# EAGLE design Controller Rev 3 (EAGLE 6.5.0)
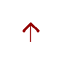
[diagram p0: schematic, sheet 1, part 1 of 3]
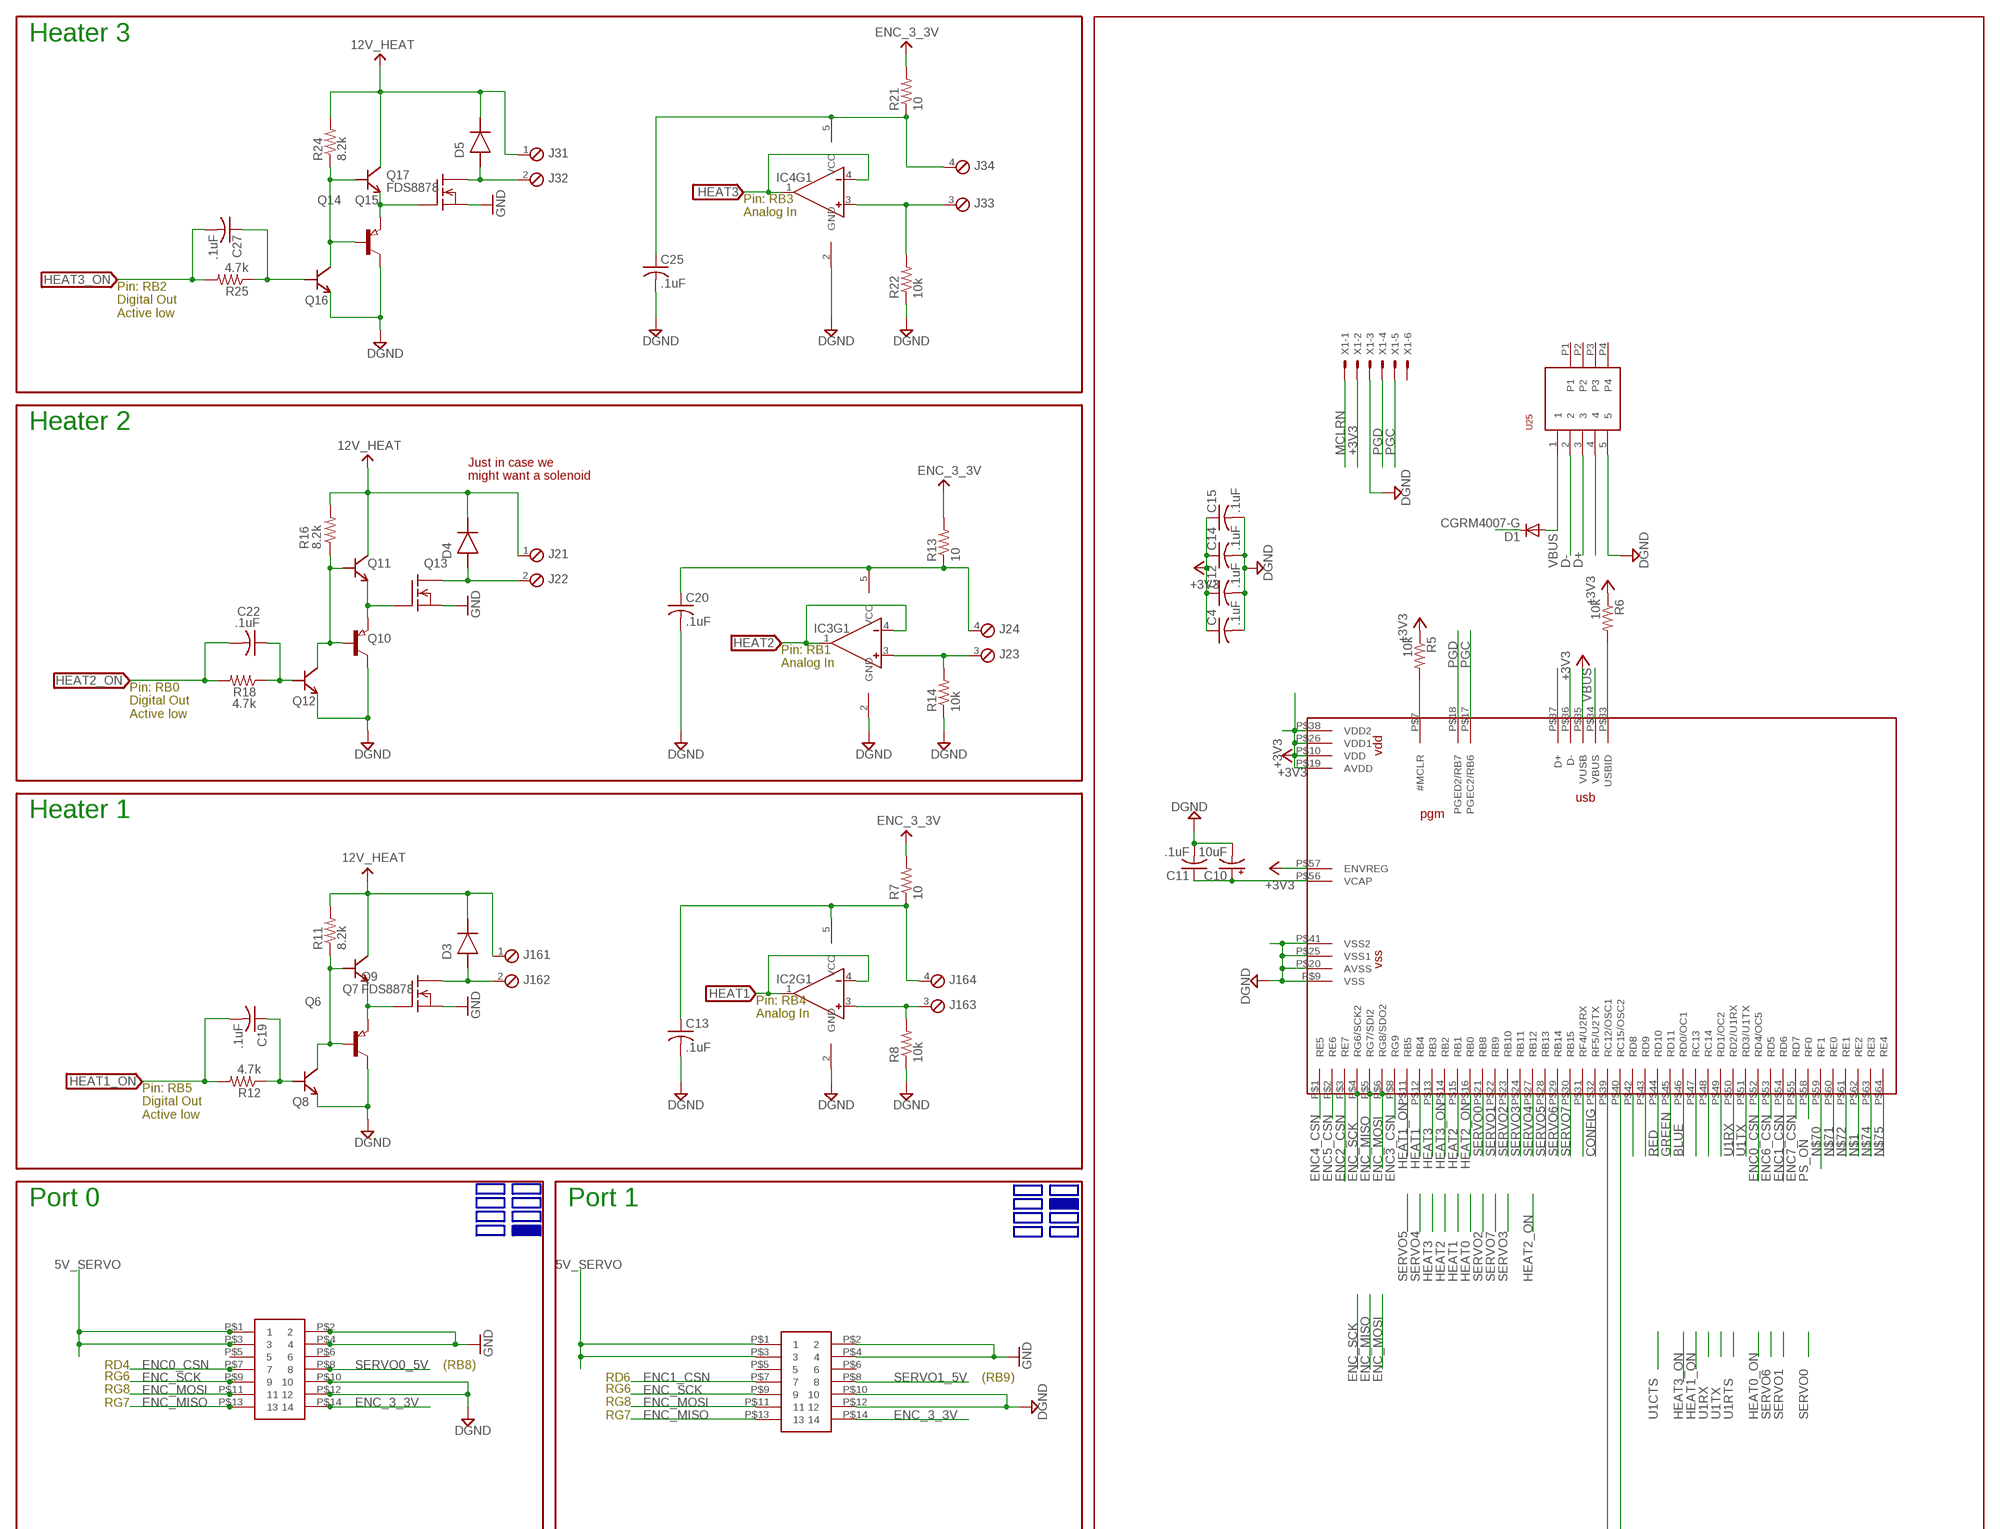
[diagram p1: schematic, sheet 1, part 2 of 3]
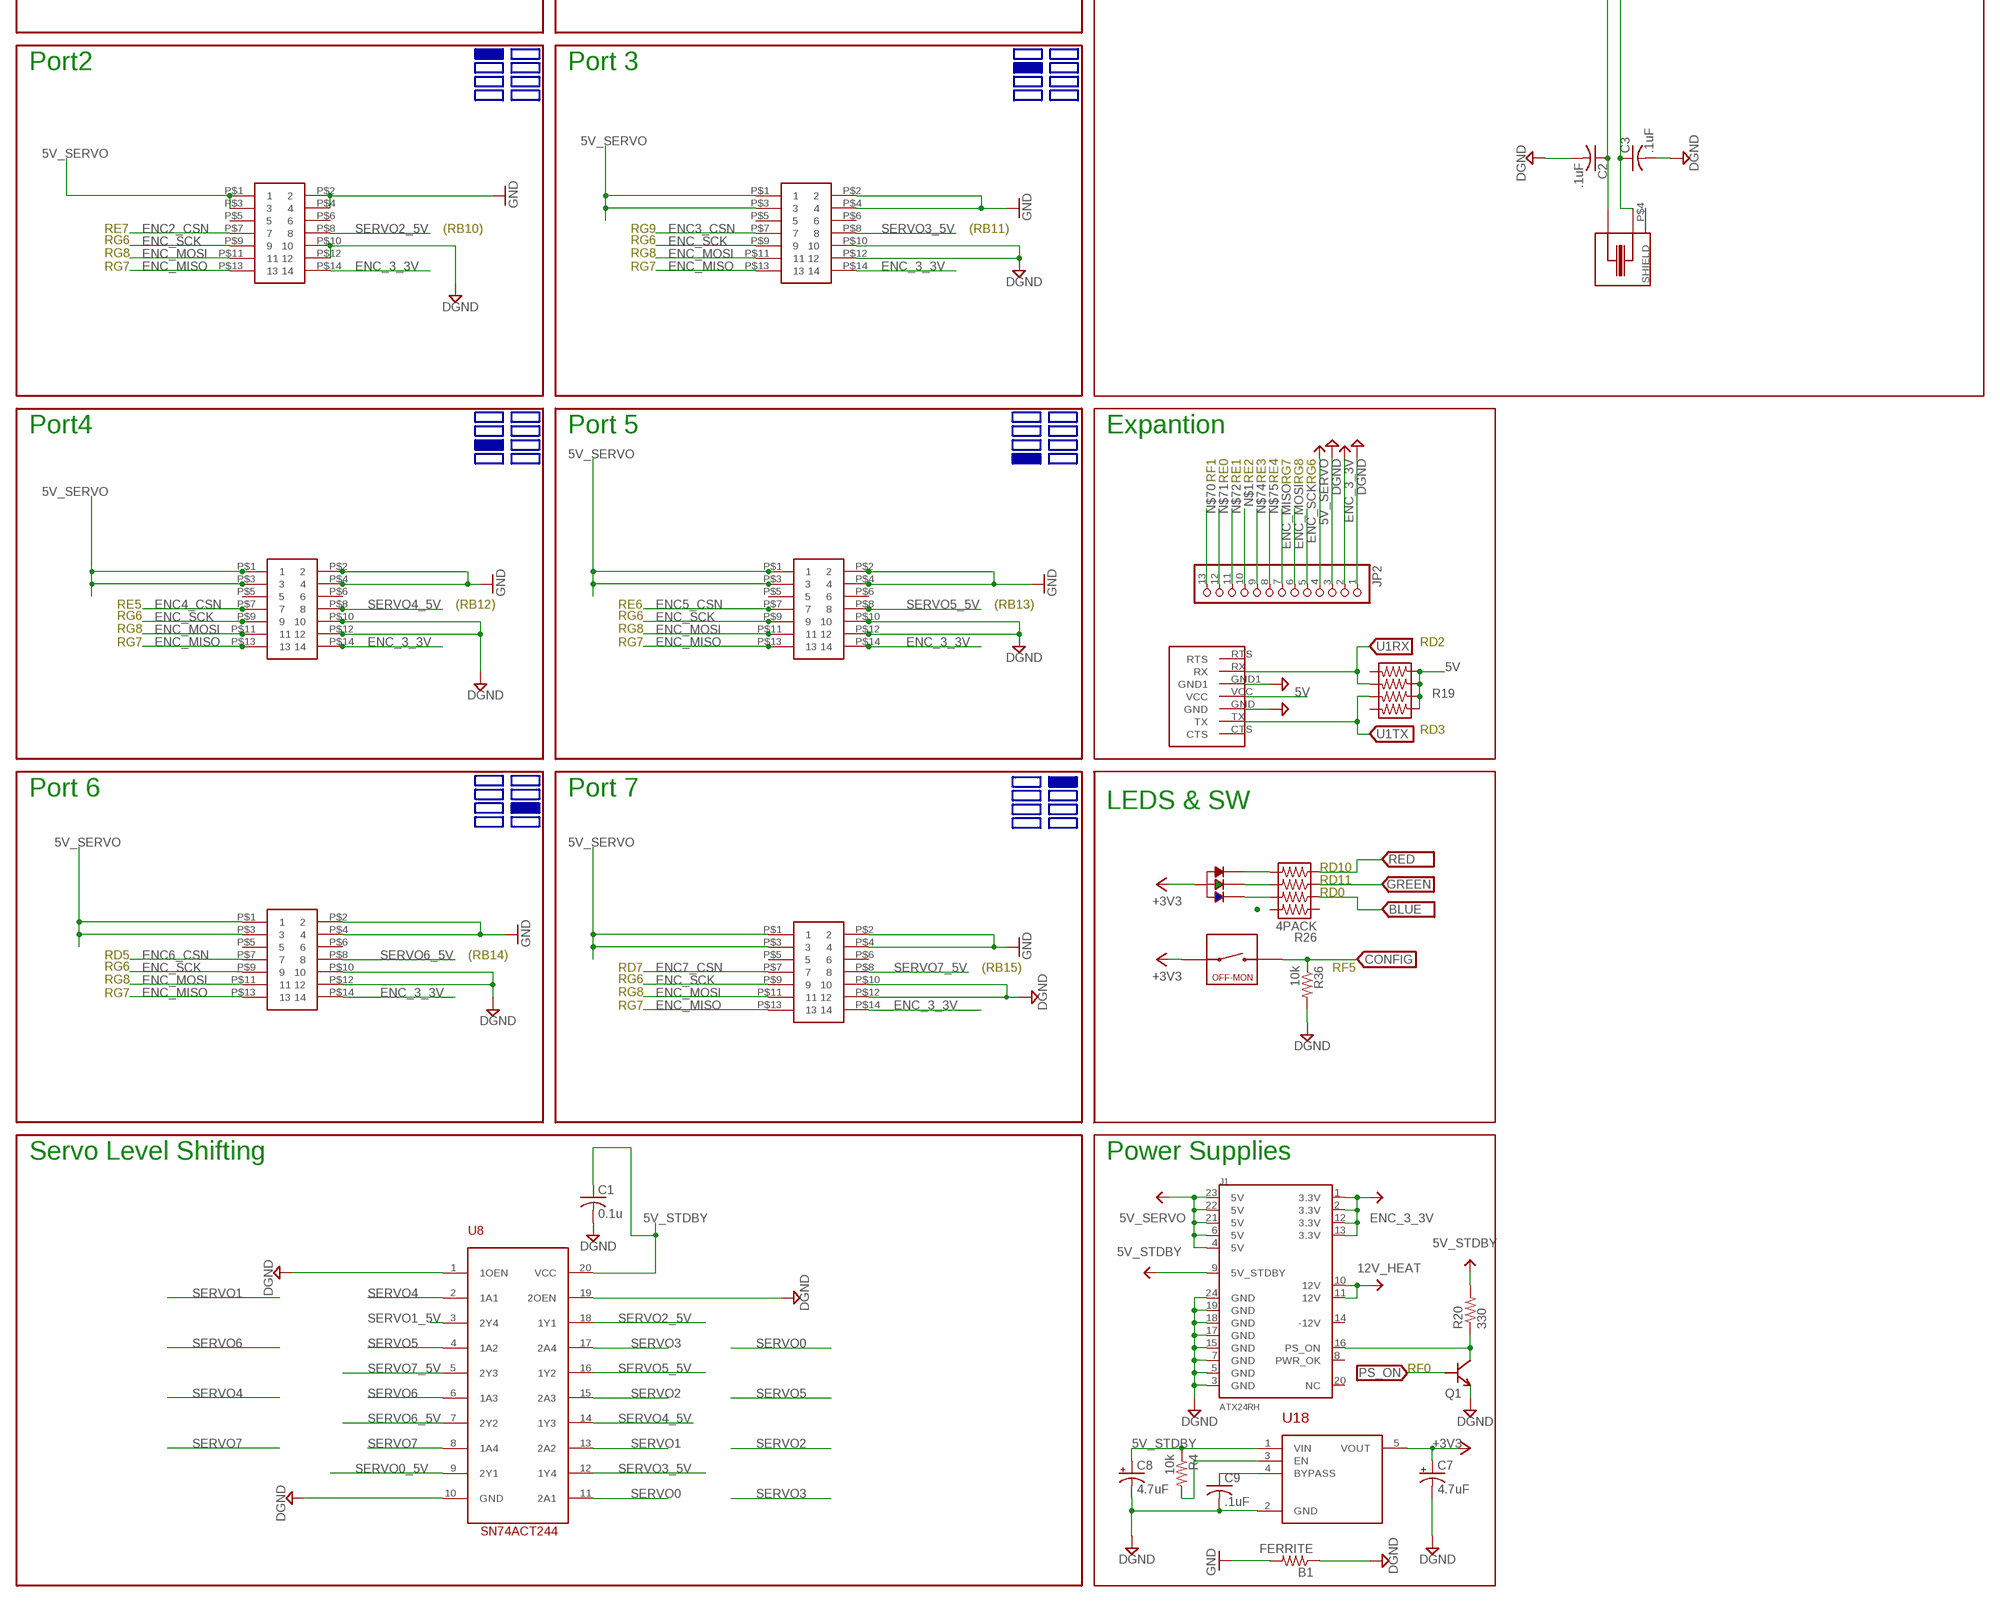
[diagram p2: schematic, sheet 1, part 3 of 3]

## Parts
B1  FERRITE  R-US_R0603  [R0603]
C1  0.1u  C-USC0402  [C0402]
C2  .1uF  C-USC0603  [C0603]
C3  .1uF  C-USC0603  [C0603]
C4  .1uF  C-USC0603  [C0603]
C7  4.7uF  CPOL-USR/2012-12R  [R/2012-12R]
C8  4.7uF  CPOL-USR/2012-12R  [R/2012-12R]
C9  .1uF  C-USC0402  [C0402]
C10  10uF  CPOL-USR/2012-12R  [R/2012-12R]
C11  .1uF  C-USC0603  [C0603]
C12  .1uF  C-USC0603  [C0603]
C13  .1uF  C-USC0603  [C0603]
C14  .1uF  C-USC0603  [C0603]
C15  .1uF  C-USC0603  [C0603]
C19  .1uF  C-USC0603  [C0603]
C20  .1uF  C-USC0603  [C0603]
C22  .1uF  C-USC0603  [C0603]
C25  .1uF  C-USC0603  [C0603]
C27  .1uF  C-USC0603  [C0603]
D1  CGRM4007-G  [SOD-123_MINI-SMA]
D3  DISCRETE_DIODESMA  [DISCRETE_SMA]
D4  DISCRETE_DIODESMA  [DISCRETE_SMA]
D5  DISCRETE_DIODESMA  [DISCRETE_SMA]
IC2  MICROCHIP_MCP6001-LT  [MICROCHIP_SC70-5-LT]
IC3  MICROCHIP_MCP6001-LT  [MICROCHIP_SC70-5-LT]
IC4  MICROCHIP_MCP6001-LT  [MICROCHIP_SC70-5-LT]
J1  ATX24RH  [ATX24_RIGHT_ANGLE]
J2  OSTVN04A150  [4POL254]
J3  OSTVN04A150  [4POL254]
J10  WASP7PIN  [WASP7PIN]
J16  OSTVN04A150  [4POL254]
JP2  PINHD-1X13_BIG  [1X13-BIG]
Q1  DISCRETE_MMBT3904LT1G  [DISCRETE_SOT23]
Q6  PNP-TRANSISTOR_SOT23  [SOT23]
Q7  DISCRETE_MMBT3904LT1G  [DISCRETE_SOT23]
Q8  DISCRETE_MMBT3904LT1G  [DISCRETE_SOT23]
Q9  FDS8878  FDS5680  [SO-8]
Q10  PNP-TRANSISTOR_SOT23  [SOT23]
Q11  DISCRETE_MMBT3904LT1G  [DISCRETE_SOT23]
Q12  DISCRETE_MMBT3904LT1G  [DISCRETE_SOT23]
Q13  FDS8878  FDS5680  [SO-8]
Q14  PNP-TRANSISTOR_SOT23  [SOT23]
Q15  DISCRETE_MMBT3904LT1G  [DISCRETE_SOT23]
Q16  DISCRETE_MMBT3904LT1G  [DISCRETE_SOT23]
Q17  FDS8878  FDS5680  [SO-8]
R4  10k  R-US_R0402  [R0402]
R5  10k  R-US_R0603  [R0603]
R6  10k  R-US_R0603  [R0603]
R7  10  R-US_R0603  [R0603]
R8  10k  R-US_R0603  [R0603]
R11  8.2k  R-US_R0603  [R0603]
R12  4.7k  R-US_R0603  [R0603]
R13  10  R-US_R0603  [R0603]
R14  10k  R-US_R0603  [R0603]
R16  8.2k  R-US_R0603  [R0603]
R18  4.7k  R-US_R0603  [R0603]
R19  4PACK  [4PACK_0603]
R20  330  R-US_R0603  [R0603]
R21  10  R-US_R0603  [R0603]
R22  10k  R-US_R0603  [R0603]
R24  8.2k  R-US_R0603  [R0603]
R25  4.7k  R-US_R0603  [R0603]
R26  4PACK  [4PACK_0603]
R36  10k  R-US_R0603  [R0603]
SW3  SPST  [B3U-1000P]
U1  TRI-LED-SMD  [TRI_LED_SMD]
U3  PIC32-64TQFP64-2  [TQFP64-2]
U8  SN74ACT244  [20-SOIC]
U18  LDS3985XX33  [SOT23-5]
U25  1734035-1_USB  [1734035-1_1734035]
U$1  SBH11-NBPC-D07-SM-BK  [SBH11-NBPC-D07-SM-BK]
U$2  SBH11-NBPC-D07-SM-BK  [SBH11-NBPC-D07-SM-BK]
U$3  SBH11-NBPC-D07-SM-BK  [SBH11-NBPC-D07-SM-BK]
U$4  SBH11-NBPC-D07-SM-BK  [SBH11-NBPC-D07-SM-BK]
U$5  SBH11-NBPC-D07-SM-BK  [SBH11-NBPC-D07-SM-BK]
U$6  SBH11-NBPC-D07-SM-BK  [SBH11-NBPC-D07-SM-BK]
U$7  SBH11-NBPC-D07-SM-BK  [SBH11-NBPC-D07-SM-BK]
U$8  SBH11-NBPC-D07-SM-BK  [SBH11-NBPC-D07-SM-BK]
X1  22-23-2061  [22-23-2061]
X2  CMR3XXT  [CMR309T]

## Nets
5V: J10.VCC R19.R1B R19.R2B R19.R3B R19.R4B
5V_SERVO: J1.4(5V) J1.6(5V) J1.21(5V) J1.22(5V) J1.23(5V) JP2.4 U$1.P$1 U$1.P$3 U$2.P$1 U$2.P$3 U$3.P$1 U$3.P$3 U$4.P$1 U$4.P$3 U$5.P$1 U$5.P$3 U$6.P$1 U$6.P$3 U$7.P$1 U$7.P$3 U$8.P$1 U$8.P$3
5V_STDBY: C1.1 C8.+ D1.C J1.9(5V_STDBY) R4.1 R20.2 U8.20(VCC) U18.1(VIN)
12V_HEAT: D3.C D4.C D5.C J1.10(12V) J1.11(12V) J2.1 J3.1 J16.1 Q7.3(C) Q11.3(C) Q15.3(C) R11.2 R16.2 R24.2
12V_SW1: D3.A J16.2 Q9.5(D) Q9.6(D) Q9.7(D) Q9.8(D)
12V_SW2: D4.A J2.2 Q13.5(D) Q13.6(D) Q13.7(D) Q13.8(D)
12V_SW3: D5.A J3.2 Q17.5(D) Q17.6(D) Q17.7(D) Q17.8(D)
+3V3: C4.1 C7.+ C12.1 C14.1 C15.1 R5.1 R6.1 SW3.P$1 U1.COMM-A U3.P$10(VDD) U3.P$19(AVDD) U3.P$26(VDD1) U3.P$35(VUSB) U3.P$38(VDD2) U3.P$57(ENVREG) U18.5(VOUT) X1.2
B: R26.R2A U1.BLUE
BLUE: R26.R2B U3.P$46(RD0/OC1)
CONFIG: R36.1 SW3.P$3 U3.P$32(RF5/U2TX)
D+: U3.P$37(D+) U25.3
D-: U3.P$36(D-) U25.2
DGND: B1.1 C1.2 C2.2 C3.2 C4.2 C7.- C8.- C9.2 C10.- C11.2 C12.2 C13.2 C14.2 C15.2 C20.2 C25.2 IC2.2(PWR:GND) IC3.2(PWR:GND) IC4.2(PWR:GND) J1.3(GND) J1.5(GND) J1.7(GND) J1.15(GND) J1.17(GND) J1.18(GND) J1.19(GND) J1.24(GND) J10.GND J10.GND1 JP2.1 JP2.3 Q1.2(E) Q6.3(C) Q8.2(E) Q10.3(C) Q12.2(E) Q14.3(C) Q16.2(E) R8.1 R14.1 R22.1 R36.2 U3.P$9(VSS) U3.P$20(AVSS) U3.P$25(VSS1) U3.P$41(VSS2) U8.1(1OEN) U8.10(GND) U8.19(2OEN) U18.2(GND) U25.5 U$1.P$10 U$1.P$12 U$2.P$10 U$2.P$12 U$3.P$10 U$3.P$12 U$4.P$10 U$4.P$12 U$5.P$10 U$5.P$12 U$6.P$10 U$6.P$12 U$7.P$10 U$7.P$12 U$8.P$10 U$8.P$12 X1.3
ENC0_CSN: U3.P$52(RD4/OC5) U$8.P$7
ENC1_CSN: U3.P$54(RD6) U$6.P$7
ENC2_CSN: U3.P$3(RE7) U$1.P$7
ENC3_CSN: U3.P$8(RG9) U$2.P$7
ENC4_CSN: U3.P$1(RE5) U$3.P$7
ENC5_CSN: U3.P$2(RE6) U$4.P$7
ENC6_CSN: U3.P$53(RD5) U$7.P$7
ENC7_CSN: U3.P$55(RD7) U$5.P$7
ENC_3_3V: J1.1(3.3V) J1.2(3.3V) J1.12(3.3V) J1.13(3.3V) JP2.2 R7.2 R13.2 R21.2 U$1.P$14 U$2.P$14 U$3.P$14 U$4.P$14 U$5.P$14 U$6.P$14 U$7.P$14 U$8.P$14
ENC_MISO: JP2.7 U3.P$5(RG7/SDI2) U$1.P$13 U$2.P$13 U$3.P$13 U$4.P$13 U$5.P$13 U$6.P$13 U$7.P$13 U$8.P$13
ENC_MOSI: JP2.6 U3.P$6(RG8/SDO2) U$1.P$11 U$2.P$11 U$3.P$11 U$4.P$11 U$5.P$11 U$6.P$11 U$7.P$11 U$8.P$11
ENC_SCK: JP2.5 U3.P$4(RG6/SCK2) U$1.P$9 U$2.P$9 U$3.P$9 U$4.P$9 U$5.P$9 U$6.P$9 U$7.P$9 U$8.P$9
G: R26.R3A U1.GRN
GND: B1.2 Q9.1(S) Q9.2(S) Q9.3(S) Q13.1(S) Q13.2(S) Q13.3(S) Q17.1(S) Q17.2(S) Q17.3(S) U$1.P$2 U$1.P$4 U$2.P$2 U$2.P$4 U$3.P$2 U$3.P$4 U$4.P$2 U$4.P$4 U$5.P$2 U$5.P$4 U$6.P$2 U$6.P$4 U$7.P$2 U$7.P$4 U$8.P$2 U$8.P$4
GREEN: R26.R3B U3.P$45(RD11)
HEAT1: IC2.1(OUT) IC2.4(IN-) U3.P$12(RB4)
HEAT1_ON: C19.2 R12.2 U3.P$11(RB5)
HEAT2: IC3.1(OUT) IC3.4(IN-) U3.P$15(RB1)
HEAT2_ON: C22.2 R18.2 U3.P$16(RB0)
HEAT3: IC4.1(OUT) IC4.4(IN-) U3.P$13(RB3)
HEAT3_ON: C27.2 R25.2 U3.P$14(RB2)
MCLRN: R5.2 U3.P$7(#MCLR) X1.1
N$1: JP2.10 U3.P$62(RE2)
N$2: R4.2 U18.3(EN)
N$3: C9.1 U18.4(BYPASS)
N$4: C3.1 U3.P$40(RC15/OSC2) X2.P$3
N$5: C10.+ C11.1 U3.P$56(VCAP)
N$6: C2.1 U3.P$39(RC12/OSC1) X2.P$1
N$7: IC2.3(IN+) J16.3 R8.2
N$9: C13.1 IC2.5(PWR:VCC) J16.4 R7.1
N$11: Q6.1(B) Q7.1(B) Q8.3(C) R11.1
N$12: C19.1 Q8.1(B) R12.1
N$15: Q6.2(E) Q7.2(E) Q9.4(G)
N$17: IC3.3(IN+) J2.3 R14.2
N$19: C20.1 IC3.5(PWR:VCC) J2.4 R13.1
N$20: Q10.1(B) Q11.1(B) Q12.3(C) R16.1
N$22: C22.1 Q12.1(B) R18.1
N$23: Q10.2(E) Q11.2(E) Q13.4(G)
N$24: IC4.3(IN+) J3.3 R22.2
N$26: C25.1 IC4.5(PWR:VCC) J3.4 R21.1
N$27: Q14.1(B) Q15.1(B) Q16.3(C) R24.1
N$28: C27.1 Q16.1(B) R25.1
N$29: Q14.2(E) Q15.2(E) Q17.4(G)
N$32: J1.16(PS_ON) Q1.3(C) R20.1
N$53: U3.P$31(RF4/U2RX)
N$55: U3.P$42(RD8)
N$56: U3.P$43(RD9)
N$60: U3.P$47(RC13)
N$61: U3.P$48(RC14)
N$62: U3.P$49(RD1/OC2)
N$70: JP2.13 U3.P$59(RF1)
N$71: JP2.12 U3.P$60(RE0)
N$72: JP2.11 U3.P$61(RE1)
N$74: JP2.9 U3.P$63(RE3)
N$75: JP2.8 U3.P$64(RE4)
PGC: U3.P$17(PGEC2/RB6) X1.5
PGD: U3.P$18(PGED2/RB7) X1.4
PS_ON: Q1.1(B) U3.P$58(RF0)
R: R26.R4A U1.RED
RED: R26.R4B U3.P$44(RD10)
SERVO0: U3.P$21(RB8) U8.11(2A1)
SERVO0_5V: U8.9(2Y1) U$8.P$8
SERVO1: U3.P$22(RB9) U8.13(2A2)
SERVO1_5V: U8.3(2Y4) U$6.P$8
SERVO2: U3.P$23(RB10) U8.15(2A3)
SERVO2_5V: U8.18(1Y1) U$1.P$8
SERVO3: U3.P$24(RB11) U8.17(2A4)
SERVO3_5V: U8.12(1Y4) U$2.P$8
SERVO4: U3.P$27(RB12) U8.2(1A1)
SERVO4_5V: U8.14(1Y3) U$3.P$8
SERVO5: U3.P$28(RB13) U8.4(1A2)
SERVO5_5V: U8.16(1Y2) U$4.P$8
SERVO6: U3.P$29(RB14) U8.6(1A3)
SERVO6_5V: U8.7(2Y2) U$7.P$8
SERVO7: U3.P$30(RB15) U8.8(1A4)
SERVO7_5V: U8.5(2Y3) U$5.P$8
U1RX: J10.RX R19.R2A U3.P$50(RD2/U1RX)
U1TX: J10.TX R19.R3A U3.P$51(RD3/U1TX)
USBID: R6.2 U3.P$33(USBID) U25.4
VBUS: D1.A U3.P$34(VBUS) U25.1
Unconnected: J1.8(PWR_OK) J1.14(-12V) J1.20(NC) J10.CTS J10.RTS R19.R1A R19.R4A R26.R1A R26.R1B U25.P1 U25.P2 U25.P3 U25.P4 U$1.P$5 U$1.P$6 U$2.P$5 U$2.P$6 U$3.P$5 U$3.P$6 U$4.P$5 U$4.P$6 U$5.P$5 U$5.P$6 U$6.P$5 U$6.P$6 U$7.P$5 U$7.P$6 U$8.P$5 U$8.P$6 X1.6 X2.P$4(SHIELD)

## Buses
B$1

## Notes on the sheet
- Heater 3
- Pin: RB3
  Analog In
- Pin: RB2
  Digital Out
  Active low
- Heater 2
- Just in case we
  might want a solenoid
- Pin: RB1
  Analog In
- Pin: RB0
  Digital Out
  Active low
- Heater 1
- Pin: RB4
  Analog In
- Pin: RB5
  Digital Out
  Active low
- Port 0 | Port 1
- RD4 | (RB8)
- RD6 | (RB9)
- RG6
  RG8
  RG7
- RG6
  RG8
  RG7
- Port2 | Port 3
- RE7 | (RB10) | RG9 | (RB11)
- RG6
  RG8
  RG7
- RG6
  RG8
  RG7
- Port4 | Port 5 | Expantion
- RF1 | RE0 | RE1 | RE2 | RE3 | RE4 | RG7 | RG8 | RG6
- RE5 | (RB12) | RE6 | (RB13)
- RG6
  RG8
  RG7
- RG6
  RG8
  RG7
- RD2
- RD3
- Port 6 | Port 7
- LEDS & SW
- RD10
- RD11
- RD0
- RD5 | (RB14)
- RD7 | (RB15) | RF5
- RG6
  RG8
  RG7
- RG6
  RG8
  RG7
- Servo Level Shifting | Power Supplies
- RF0

## Library data of the parts
B1 R4-R8 R11-R14 R16 R18 R20-R22 R24 R25 R36 = rcl:R-US_: RESISTOR, American symbol
C1 = resistor:C-US: CAPACITOR, American symbol
C2-C4 C9 C11-C15 C19 C20 C22 C25 C27 = rcl:C-US: CAPACITOR, American symbol
C7 C8 C10 = rcl:CPOL-US: POLARIZED CAPACITOR, American symbol
D1 = diode:CGRM400*-G: Molded plasitc,JEDEC SOD-123/Mini SMA Source: Comchip CGRM4001-G.pdf
D3-D5 = chipKIT_Max32:DISCRETE_DIODE: Diode
IC2-IC4 = chipKIT_Max32:MICROCHIP_MCP6001: 1 Mhz Low Power Op Amp
J1 = SparkFun-Connectors:ATX24: ATX24 Pin Power Supply Connector This is a good connector for connecting a computer power supply to a PCB. It's massive, but provides many amps of power at 5V and 12V. SKU: PRT-09498
J2 J3 J16 = con-OST-254:OSTVN04A150
J10 = wasp7pin:WASP7PIN
JP2 = adafruit:PINHD-1X13: PIN HEADER
Q1 Q7 Q8 Q11 Q12 Q15 Q16 = chipKIT_Max32:DISCRETE_MMBT3904: General Purpose NPN Transistor
Q6 Q10 Q14 = semicon-smd-ipc:PNP-TRANSISTOR_: PNP TRANSISTOR
Q9 Q13 Q17 = transistor-fet:FDS5680: 60V N-Channel PowerTrench TM MOSFET FAIRCHILD FDS5680.pdf
R19 R26 = ResistorBlocks:4PACK: This is a 0603x4 resistor block. Digikey PN:MNR14103RCT-ND
SW3 = B3U-1000P:SPST
U1 = TRI_LED_SMD:TRI-LED-SMD: Common Annode smd tri-color RGB led.
U3 = pic32:PIC32-64
U8 = SN74ACT244:SN74ACT244
U18 = LDS3985XX33:LDS3985XX33
U25 = YESIN_USB:1734035-1_USB
U$1-U$8 = SBH11-NBPC-D07-SM-BK:SBH11-NBPC-D07-SM-BK
X1 = con-molex:22-23-2061: .100" (2.54mm) Center Header - 6 Pin; MF: MOLEX; MPN: 22-23-2061; OC_FARNELL: 1462922; OC_NEWARK: 27C1933
X2 = cmr3XXT:CMR3XXT

## Board
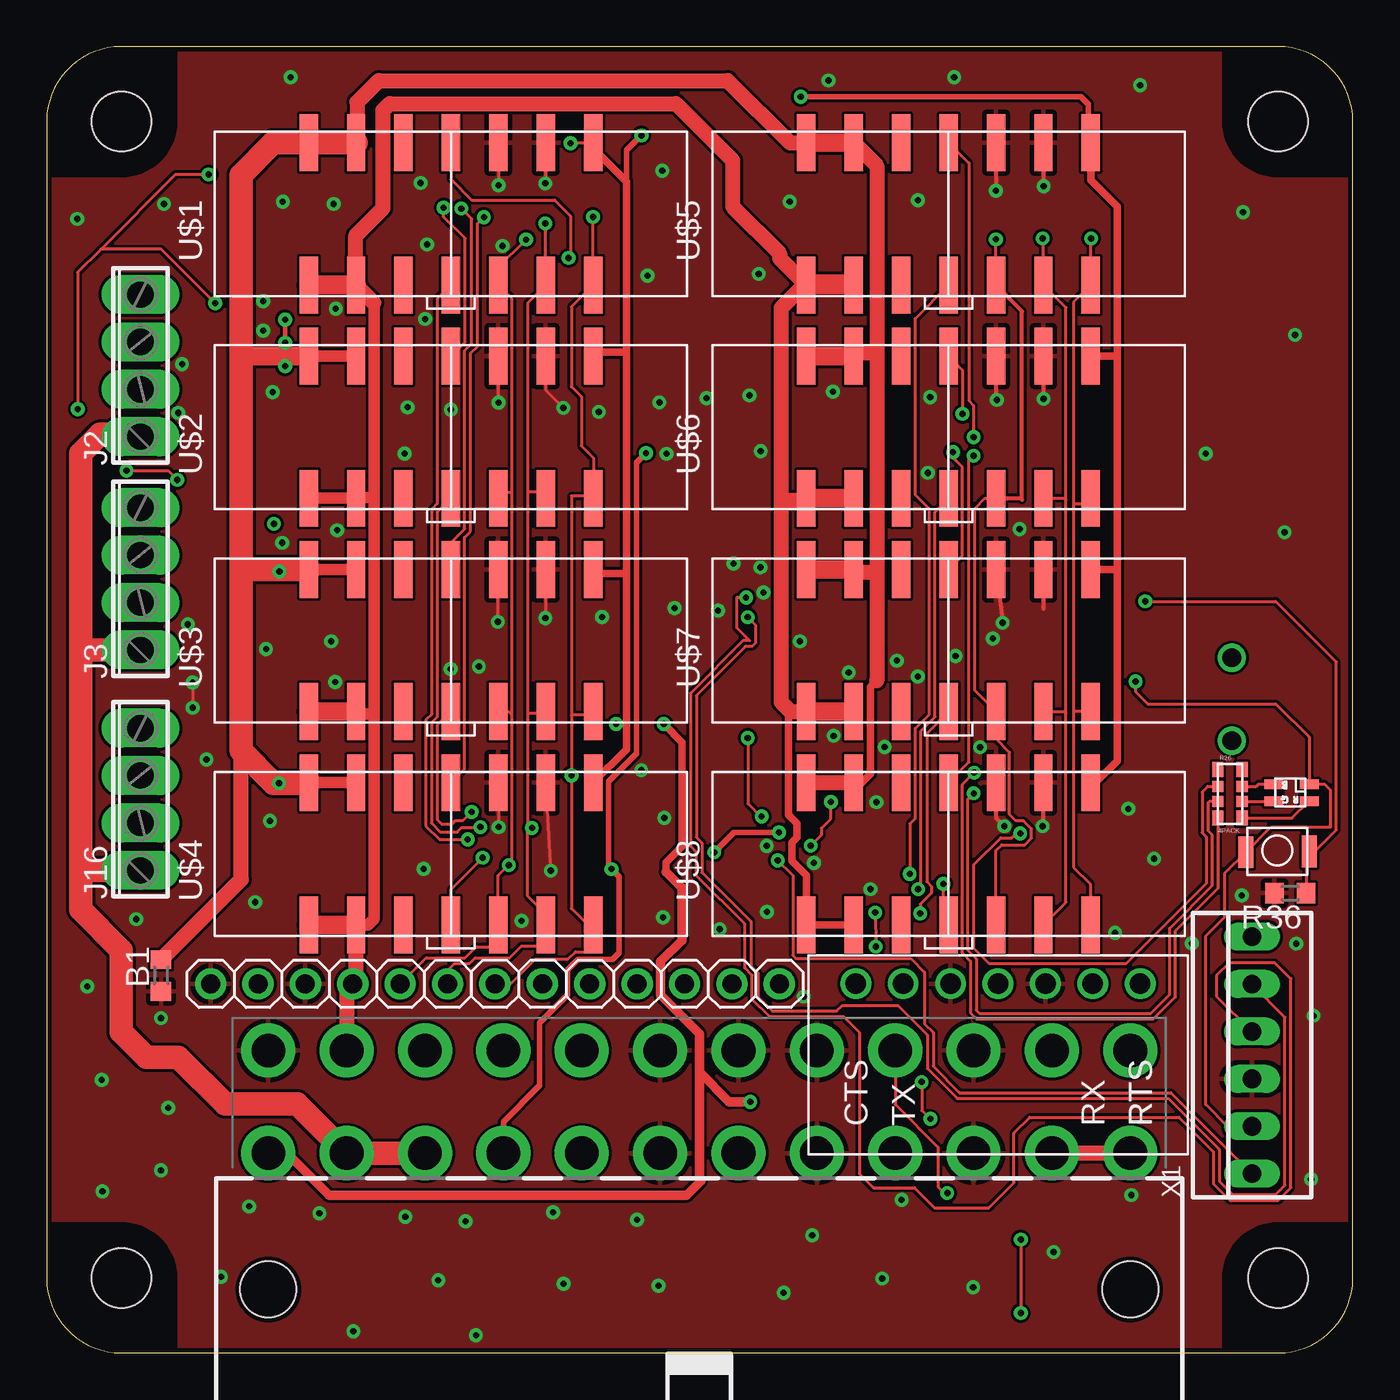
[diagram p3: board, top side]
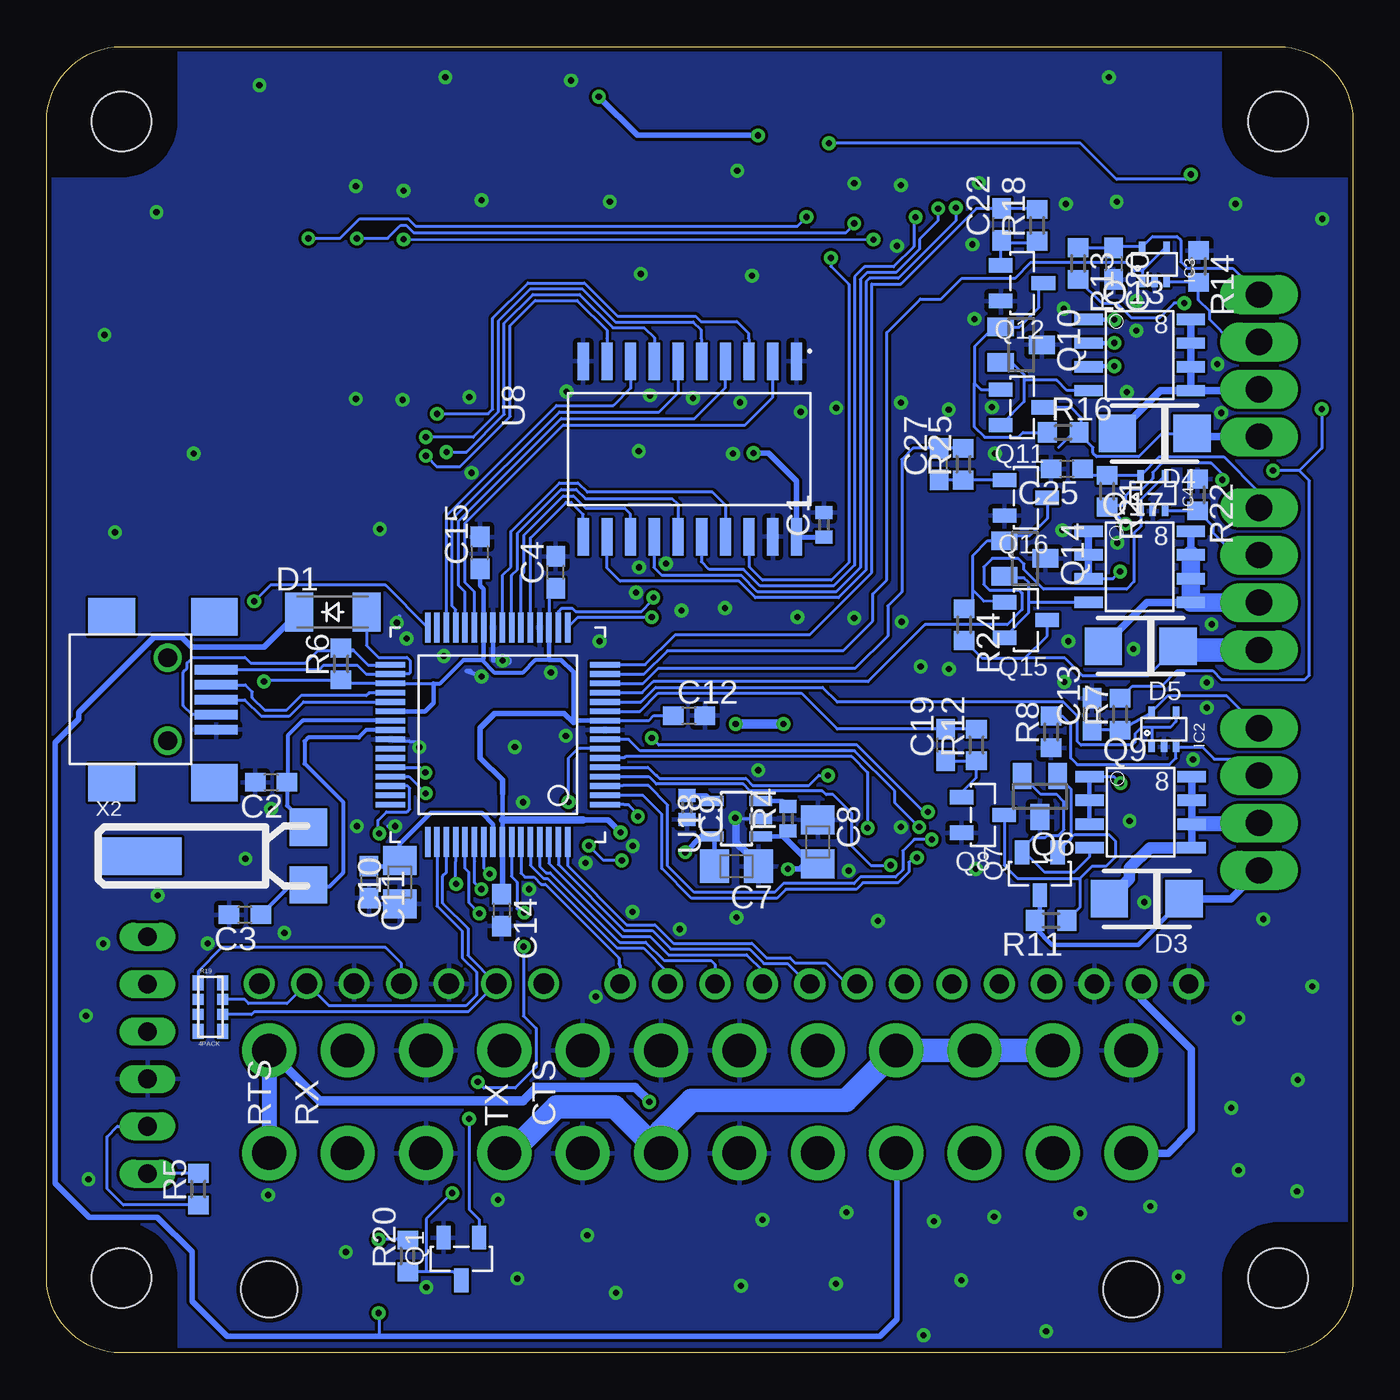
[diagram p4: board, bottom side, seen from below]

Size 70 x 70 mm. Coordinates in mm from the lower left corner, seen from the top.
Copper layers (1*16): Top 0.035mm / dielectric 1.5mm / Bottom 0.035mm
Design rules "default *": minimum track width 6mil, minimum drill 13mil, track to track 6mil, track to pad 6mil, pad to pad 6mil, via to via 6mil, smd to smd 6mil, copper to edge 10mil, drill to drill 6mil, minimum pad ring 10mil, minimum via ring 8mil, stop-mask expansion 4mil, vias tented up to drill 30mil, thermal gap 10mil

### Footprints (pad centres in the part's own frame; a part is rotated, then mirrored left to right if it is on the bottom)
R0603 = smd 1 x 1.1: 1 -0.85,0; 2 0.85,0
C0402 = smd 0.7 x 0.9: 1 -0.65,0; 2 0.65,0
C0603 = smd 1.1 x 1: 1 -0.85,0; 2 0.85,0
R/2012-12R = smd 1.55 x 1.8: + 1.175,0; - -1.175,0
SOD-123_MINI-SMA = smd 1.5 x 2.1: A 1.8,0; C -1.8,0
DISCRETE_SMA = smd 2 x 2: A 2,0; C -2,0
MICROCHIP_SC70-5-LT = smd 0.35 x 0.55: 1 -0.65,-0.95; 2 0,-0.95; 3 0.65,-0.95; 4 0.65,0.95; 5 -0.65,0.95
ATX24_RIGHT_ANGLE = drill 1.8 pad 2.9: 1 23.1,4.76; 2 18.9,4.76; 3 14.7,4.76; 4 10.5,4.76; 5 6.3,4.76; 6 2.1,4.76; 7 -2.1,4.76; 8 -6.3,4.76; 9 -10.5,4.76; 10 -14.7,4.76; 11 -18.9,4.76; 12 -23.1,4.76; 13 23.1,10.26; 14 18.9,10.26; 15 14.7,10.26; 16 10.5,10.26; 17 6.3,10.26; 18 2.1,10.26; 19 -2.1,10.26; 20 -6.3,10.26; 21 -10.5,10.26; 22 -14.7,10.26; 23 -18.9,10.26; 24 -23.1,10.26 | hole 3: -23.1,-2.54; 23.1,-2.54
4POL254 = drill 1.4 long: 1 -3.81,0; 2 -1.27,0; 3 1.27,0; 4 3.81,0
WASP7PIN = drill 1.1: CTS 0,0; GND 5.08,0; GND1 10.16,0; RTS 15.24,0; RX 12.7,0; TX 2.54,0; VCC 7.62,0
1X13-BIG = drill 1.016 pad 1.676: 1 -15.24,0; 2 -12.7,0; 3 -10.16,0; 4 -7.62,0; 5 -5.08,0; 6 -2.54,0; 7 0,0; 8 2.54,0; 9 5.08,0; 10 7.62,0; 11 10.16,0; 12 12.7,0; 13 15.24,0
DISCRETE_SOT23 = smd 0.762 x 1.27: 1 -0.953,-1.143; 2 0.953,-1.143; 3 0,1.143
SOT23 = smd 1 x 1.4: 1 -0.95,-1.1; 2 0.95,-1.1; 3 0,1.1
SO-8 = smd 1.524 x 0.61: 1 -2.743,1.905; 2 -2.743,0.635; 3 -2.743,-0.635; 4 -2.743,-1.905; 5 2.743,-1.905; 6 2.743,-0.635; 7 2.743,0.635; 8 2.743,1.905
R0402 = smd 0.7 x 0.9: 1 -0.65,0; 2 0.65,0
4PACK_0603 = smd 0.8 x 0.6: R1A -2.78,-0.6; R1B -2.78,-1.9; R4A -0.18,-0.6; R4B -0.18,-1.9 | smd 0.6 x 0.6: R2A -1.88,-0.6; R2B -1.88,-1.9; R3A -1.08,-0.6; R3B -1.08,-1.9
B3U-1000P = smd 0.8 x 1.7: P$1 0.4,-0.1; P$3 3.8,-0.05
TRI_LED_SMD = smd 1.016 x 0.508: BLUE 1.7,-1.2; COMM-A -0.2,-1.2; GRN 1.7,-0.3; RED -0.2,-0.3
TQFP64-2 = smd 1.6 x 0.3: P$1 0,-2; P$2 0,-2.5; P$3 0,-3; P$4 0,-3.5; P$5 0,-4; P$6 0,-4.5; P$7 0,-5; P$8 0,-5.5; P$9 0,-6; P$10 0,-6.5; P$11 0,-7; P$12 0,-7.5; P$13 0,-8; P$14 0,-8.5; P$15 0,-9; P$16 0,-9.5; P$33 11.5,-9.5; P$34 11.5,-9; P$35 11.5,-8.5; P$36 11.5,-8; P$37 11.5,-7.5; P$38 11.5,-7; P$39 11.5,-6.5; P$40 11.5,-6; P$41 11.5,-5.5; P$42 11.5,-5; P$43 11.5,-4.5; P$44 11.5,-4; P$45 11.5,-3.5; P$46 11.5,-3; P$47 11.5,-2.5; P$48 11.5,-2 | smd 0.3 x 1.6: P$17 2,-11.5; P$18 2.5,-11.5; P$19 3,-11.5; P$20 3.5,-11.5; P$21 4,-11.5; P$22 4.5,-11.5; P$23 5,-11.5; P$24 5.5,-11.5; P$25 6,-11.5; P$26 6.5,-11.5; P$27 7,-11.5; P$28 7.5,-11.5; P$29 8,-11.5; P$30 8.5,-11.5; P$31 9,-11.5; P$32 9.5,-11.5; P$49 9.5,0; P$50 9,0; P$51 8.5,0; P$52 8,0; P$53 7.5,0; P$54 7,0; P$55 6.5,0; P$56 6,0; P$57 5.5,0; P$58 5,0; P$59 4.5,0; P$60 4,0; P$61 3.5,0; P$62 3,0; P$63 2.5,0; P$64 2,0
20-SOIC = smd 2 x 0.6: 1 -4.7,5.75; 2 -4.7,4.48; 3 -4.7,3.21; 4 -4.7,1.94; 5 -4.7,0.67; 6 -4.7,-0.6; 7 -4.7,-1.87; 8 -4.7,-3.14; 9 -4.7,-4.41; 10 -4.7,-5.68; 11 4.7,-5.68; 12 4.7,-4.41; 13 4.7,-3.14; 14 4.7,-1.87; 15 4.7,-0.6; 16 4.7,0.67; 17 4.7,1.94; 18 4.7,3.21; 19 4.7,4.48; 20 4.7,5.75
SOT23-5 = smd 0.55 x 1.2: 1 -0.95,-1.3; 2 0,-1.3; 3 0.95,-1.3; 4 0.95,1.3; 5 -0.95,1.3
1734035-1_1734035 = smd 2.3 x 0.5: 1 -1.15,1.6; 2 -1.15,0.8; 3 -1.15,0; 4 -1.15,-0.8; 5 -1.15,-1.6 | smd 2.5 x 2: P1 -6.75,4.45; P2 -1.25,4.45; P3 -1.25,-4.45; P4 -6.75,-4.45 | drill 1 pad 1.3: P$1 -3.75,-2.2; P$2 -3.75,2.25
SBH11-NBPC-D07-SM-BK = smd 0.991 x 3.048: P$1 -7.62,-3.81; P$2 -7.62,3.81; P$3 -5.08,-3.81; P$4 -5.08,3.81; P$5 -2.54,-3.81; P$6 -2.54,3.81; P$7 0,-3.81; P$8 0,3.81; P$9 2.54,-3.81; P$10 2.54,3.81; P$11 5.08,-3.81; P$12 5.08,3.81; P$13 7.62,-3.81; P$14 7.62,3.81
DP7070_V1 = hole 3.2: -31,-31; 31,-31; 31,31; -31,31
22-23-2061 = drill 1 long: 1 -6.35,0; 2 -3.81,0; 3 -1.27,0; 4 1.27,0; 5 3.81,0; 6 6.35,0
CMR309T = smd 2 x 2: P$1 1,1.7; P$3 1,-1.4 | smd 4.5 x 2: P$4 -8.05,0.15

### Placement (x,y rotation side)
B1  6.14,20.23 90 top
C1  28.35,44.38 90 bottom
C2  57.98,30.58 180 bottom
C3  59.38,23.48 180 bottom
C4  42.72,41.84 90 bottom
C7  33.03,26.08 180 bottom
C8  28.68,27.38 270 bottom
C9  35.68,29.23 270 bottom
C10  51.08,25.23 90 bottom
C11  52.73,25.23 270 bottom
C12  35.58,34.15 0 bottom
C13  13.98,34.23 90 bottom
C14  45.62,23.73 270 bottom
C15  46.78,42.88 90 bottom
C19  21.83,32.58 90 bottom
C20  12.83,58.38 270 bottom
C22  18.83,60.48 90 bottom
C25  15.33,47.38 180 bottom
C27  22.18,47.62 90 bottom
D1  54.67,39.71 0 bottom
D3  11.05,24.34 180 bottom
D4  10.63,49.28 180 bottom
D5  11.38,37.88 180 bottom
IC2  10.13,33.43 0 bottom
IC3  10.64,58.34 0 bottom
IC4  10.73,46.08 0 bottom
J1  34.97,5.94 0 top
J2  5.03,52.91 90 top
J3  5.03,41.48 90 top
J10  43.37,19.79 0 top
J16  5.03,29.67 90 top
JP2  24.03,19.78 0 top
Q1  47.78,5.04 180 bottom
Q6  16.78,29.83 180 bottom
Q7  16.78,25.68 180 bottom
Q8  19.83,28.83 270 bottom
Q9  11.38,28.98 0 bottom
Q10  17.78,54.03 270 bottom
Q11  17.73,50.68 270 bottom
Q12  17.73,57.33 270 bottom
Q13  11.43,53.48 0 bottom
Q14  17.58,42.58 270 bottom
Q15  17.53,39.28 270 bottom
Q16  17.53,45.83 270 bottom
Q17  11.43,42.12 0 bottom
R4  30.28,28.63 90 bottom
R5  61.88,8.78 90 bottom
R6  54.23,36.93 90 bottom
R7  12.48,34.23 90 bottom
R8  16.18,33.28 90 bottom
R11  16.18,23.18 180 bottom
R12  20.18,32.58 90 bottom
R13  14.73,58.38 270 bottom
R14  8.28,58.23 270 bottom
R16  15.53,49.33 0 bottom
R18  16.93,60.43 90 bottom
R19  59.98,17.06 270 bottom
R20  50.66,5.2 90 bottom
R21  13.18,46.18 270 bottom
R22  8.33,45.98 270 bottom
R24  20.83,39.03 270 bottom
R25  20.88,47.62 90 bottom
R26  64.67,28.48 270 top
R36  66.64,24.64 180 top
SW3  63.86,26.93 0 top
U1  67.45,29.28 180 top
U3  40.08,27.38 180 bottom
U8  35.57,48.44 270 bottom
U18  33.03,28.63 90 bottom
U25  59.77,35 0 bottom
U$1  21.67,61.04 0 top
U$2  21.67,49.61 0 top
U$3  21.67,38.18 0 top
U$4  21.67,26.75 0 top
U$5  48.34,61.04 0 top
U$6  48.34,49.61 0 top
U$7  48.34,38.18 0 top
U$8  48.34,26.75 0 top
U$9  [DP7070_V1]  35,35 0 top
X1  64.59,15.95 90 top
X2  56.98,26.48 0 bottom

### Tracks (layer width: path | path; a pad name or v marks a point on that pad's centre or on a via)
5V
  Bottom 0.152: R19.R4B R19.R3B R19.R2B R19.R1B 61.88,20.46 60.62,21.72 51.84,21.72 50.98,20.87 J10.VCC
5V_SERVO
  Top 0.152: U$1.P$1 14.07,57.23
  Top 0.406: 39.68,34.55 39.75,34.48 39.75,28.83 40.21,28.37 40.21,27.62 39.94,27.35 39.94,26.38 40.72,25.6 U$8.P$1 U$8.P$3
  Top 0.61: 17.55,56.27 17.55,45.83 | 17.55,45.83 17.55,34.23 | 17.55,34.23 17.55,23.26 17.23,22.94 U$4.P$3 | U$2.P$1 U$2.P$3 16.62,45.83 17.55,45.83 | U$3.P$3 16.72,34.23 17.55,34.23 | U$7.P$3
  Top 0.813: 17.55,56.27 U$1.P$3 16.57,57.25 16.57,59.88 18.03,61.34 18.03,66.59 18.39,66.95 33.72,66.95 36.77,63.91 36.77,61.43 39.3,58.9 39.3,58.65 U$5.P$1 | U$5.P$3 43.11,57.38 40.73,57.38 39.36,56 39.36,45.67 | 39.36,45.67 39.36,34.88 39.68,34.55 39.87,34.37 U$7.P$1 | U$6.P$1 40.59,45.67 39.36,45.67 | 15.14,22.94 15.17,22.94 | J1.23 16.08,19.45 JP2.4 16.59,19.96 U$4.P$3
  Top 1: U$4.P$1 15.17,22.94 U$4.P$3 | U$3.P$1 U$3.P$3 | U$1.P$1 U$1.P$3 | U$7.P$3 U$7.P$1 | U$6.P$3 U$6.P$1 | U$5.P$3 U$5.P$1 | 14.07,57.23 16.61,57.23
  Bottom 1.27: J1.23 J1.22 J1.21 27.15,13.53 35.46,13.53 37.08,11.91 J1.6 39.56,13.19 42.69,13.19 45.17,10.7 J1.4
5V_STDBY  (via drill 0.33)
  Top 0.152: v52.21,6.08 v52.21,2.14
  Top 0.305: J1.9 24.48,12.38 26.43,14.33 26.43,17.68 27.93,19.18 27.93,20.53 28.48,21.08 30.33,21.08 30.68,21.43 30.68,25.53 v30.28,25.93 30.11,26.1 30.11,30.63 31.61,32.12 31.61,47.71 v32.12,48.23
  Bottom 0.152: R20.2 50.69,6.08 v52.21,6.08 | v52.21,2.14 52.19,2.12 52.19,0.9
  Bottom 0.254: R4.1 30.58,27.68 U18.1
  Bottom 0.305: C8.+ 29.05,26.2 29.2,26.35 | 29.2,26.35 30.53,27.68 30.53,27.73 R4.1 | v30.28,25.93 29.63,25.93 29.2,26.35 | C1.1 29.85,43.71 U8.20 29.82,46.72 31.33,48.23 v32.12,48.23 | D1.C 58.36,37.82 62.22,37.82 62.75,38.35 64.27,38.35 68.28,34.33 68.28,33.97 69.55,32.71 69.55,9.09 67.73,7.27 64.06,7.27 62.21,5.41 62.21,2.78 60.33,0.9 52.19,0.9 25.34,0.9 24.43,1.81 24.43,10.65 J1.9
12V_HEAT
  Top 1.27: J1.10 J1.11 13.43,13.35 9.56,13.35 7.06,15.85 5.37,15.85 4.01,17.21 4.01,21.58 1.83,23.76 1.83,25.88 | 1.83,25.88 1.83,37.58 | 1.83,37.58 1.83,48.21 2.87,49.25 4.88,49.25 J2.1 | J16.1 1.84,25.86 1.83,25.88 | J3.1 1.92,37.67 1.83,37.58
  Bottom 0.152: Q11.3 15.13,50.68 14.58,50.12 14.58,49.23 | 14.58,49.18 14.63,49.12 14.68,49.18 15.13,49.18 15.78,48.53 | 8.73,49.23 10.28,49.23 11.48,48.03 13.73,48.03 13.93,48.23 13.93,48.53 14.58,49.18 | 14.58,49.18 14.58,49.23 | 14.58,49.23 R16.2 | R24.2 19.88,37.23 17.58,37.23 | 17.58,37.23 16.38,38.42 Q15.3 | D5.C 10.98,36.28 14.48,36.28 15.43,37.23 17.58,37.23
  Bottom 0.254: Q7.3 16.78,23.23 R11.2 17.03,22.78 16.13,21.88 11.51,21.88 D3.C
  Bottom 0.406: J2.1 8.7,49.1 8.73,49.12 | 8.73,49.12 8.73,49.23 8.63,49.33 | 8.73,49.12 8.63,49.23 D4.C | D3.C 6.55,24.34 J16.1
  Bottom 1.27: J3.1 9.17,37.67 D5.C
12V_SW1
  Bottom 0.406: Q9.5 Q9.6 Q9.7 Q9.8
  Bottom 0.61: Q9.5 10.88,27.07 11.98,25.98 11.98,25.41 D3.A
  Bottom 0.813: J16.2 5.08,28.34 Q9.6
12V_SW2
  Bottom 0.406: Q13.8 Q13.7 Q13.6 Q13.5 | Q13.5 5.1,51.57 J2.2 | D4.A 10.33,51.57 Q13.5
12V_SW3
  Bottom 0.406: Q17.7 Q17.8 | D5.A 11.03,40.22 Q17.5
  Bottom 1: J3.2 5.04,40.22 Q17.5 Q17.6 Q17.7
+3V3  (via drill 0.33)
  Top 0.152: X1.2 63.28,12.14 62.12,13.31 62.12,22.34 63.12,23.34 63.12,25.69 SW3.P$1 65.61,28.18 68.8,28.18 68.8,30.16 68.48,30.48 U1.COMM-A 67.66,33 65.87,34.79 59.03,34.79 58.36,35.46 v58.36,35.98
  Top 0.305: v39.25,27.9 36.85,27.9 v35.78,26.83
  Bottom 0.152: 54.23,36.03 54.08,35.88 U3.P$35 49.28,35.88 | 54.23,36.03 R6.1 | U3.P$10 37.73,33.88 37.47,34.15 C12.1 | C4.1 43.08,40.62 U3.P$19 | 54.23,36.03 58.3,36.03 v58.36,35.98 | R5.1 65.89,7.93 66.77,8.8 66.77,11.59 66.21,12.14 X1.2 | 45.62,24.73 C14.1 | C15.1 46.73,41.98
  Bottom 0.203: 49.28,35.88 48.92,35.88 47.67,37.12 | 43.08,37.12 43.82,37.12 44.51,36.44 45.98,36.44 46.68,37.12
  Bottom 0.254: 46.73,41.98 46.78,41.98 46.78,41.12 46.58,40.93 U3.P$26 46.58,37.22 46.68,37.12 47.67,37.12 | U3.P$38 49.72,34.38 49.28,34.83 49.28,35.88 | 41.78,33.88 41.78,36.48 42.43,37.12 43.08,37.12 U3.P$19 | 45.58,29.97 45.58,28.57 U3.P$57 | U3.P$10 41.78,33.88 | 41.78,33.88 41.78,33.78 | U18.5 34.2,27.55 C7.+
  Bottom 0.305: U18.5 34.93,27.68 v35.78,26.83 | 45.62,24.73 45.73,24.63 | U3.P$57 45.58,24.62 C14.1 | 45.58,29.97 45.58,30.7 46.77,31.89 46.77,33.48 45.98,34.27 42.27,34.27 41.78,33.78 | 41.27,28.56 39.91,28.56 v39.25,27.9
  Bottom 0.406: 45.58,28.57 45.05,28.57 45.05,28.56 41.27,28.56
B
  Top 0.152: R26.R2A 64.81,30.36 64.94,30.48 U1.BLUE
BLUE  (via drill 0.33)
  Top 0.152: 62.68,30.36 R26.R2B 62.23,30.36 61.93,30.06 61.93,27.87 62.15,27.65 62.15,25.16 57.85,20.86 50.52,20.86 49.69,21.69 49.69,26.17 51.12,27.61 51.72,27.61 51.95,27.84 v52.18,27.84
  Bottom 0.152: v52.18,27.84 52.3,27.87 52.25,27.92 52.25,28.54 51.79,29 50.69,29 50.55,29.14 50.55,30.27 50.66,30.38 U3.P$46
CONFIG  (via drill 0.33)
  Top 0.152: SW3.P$3 67.5,26.72 | 67.5,26.72 R36.1 | 67.5,26.72 67.81,26.72 69.12,28.03 69.12,37.03 65.87,40.28 | 65.87,40.28 65.86,40.29 | v58.88,40.28 65.87,40.28
  Bottom 0.152: U3.P$32 51.85,41.15 58.01,41.15 v58.88,40.28
D+
  Bottom 0.152: U25.3 59.38,35 58.48,34.11 57.01,34.11 56.23,34.88 U3.P$37
D-
  Bottom 0.152: U25.2 59.35,35.8 58.98,35.43 58.98,35.11 58.3,34.43 57.17,34.43 56.37,35.23 52.88,35.23 52.73,35.38 U3.P$36
DGND  (via drill 0.33)
  Top 0.152: U$1.P$12 26.73,64.83 v26.73,62.68 | U$1.P$10 24.23,64.83 v24.23,62.58 | U$2.P$12 26.75,51.61 v27.69,50.65 | U$2.P$10 24.21,51.3 v24.23,50.93 | U$3.P$12 26.73,41.97 v26.73,39.38 | U$3.P$10 24.18,41.96 v24.18,39.18 | U$4.P$12 26.73,30.54 v27.02,25.84 | U$4.P$10 24.23,30.54 v24.23,28.18 | v7.83,35.93 v7.83,34.58
  Top 0.203: U$8.P$12 53.38,30.52 v53.38,28.23 | U$8.P$10 50.88,28.68 v51.33,28.23 | U$7.P$10 v51.23,39.12 | U$7.P$12 53.42,39.98 53.43,39.88 | U$6.P$12 53.42,51.44 53.43,51.43 v53.43,51.12 | U$6.P$10 50.88,51.12 v50.93,51.08 | U$5.P$12 v53.42,62.54 v53.43,62.53 | U$5.P$10 v50.88,62.28
  Bottom 0.152: v26.73,62.68 26.78,62.62 26.83,62.62 | v24.23,62.58 24.33,62.58 | v24.23,28.18 24.33,28.18 | 33.1,28.63 U18.2 31.65,28.63 31.65,28.57 | U3.P$41 51.5,32.8 50.57,32.8 50.57,32.77 50.03,32.77 50.03,32.57 | 50.03,32.57 50.02,32.57 v50.02,32.46 v50.03,32.46 50.03,32.57 | 31.87,26.37 C7.- 32.44,26.08 32.44,26.77
  Bottom 0.203: v53.38,28.23 53.38,28.08 | v51.33,28.23 51.68,28.23 | v51.23,39.12 51.09,39.47 | v53.43,51.12 53.58,51.12 53.62,51.08 | v50.93,51.08 50.98,51.08 51.03,51.03 | v53.43,62.53 53.43,62.48 53.53,62.38 | v50.88,62.28 51.03,62.28
  Bottom 0.254: U3.P$25 46.08,37.1 v45.57,37.1 | v46.7,36.25 47.48,36.55 47.28,36.55
  Bottom 0.406: v45.57,37.1 45.28,37.1 45.28,37.05 | 32.44,26.77 32.45,26.77 33.05,27.37 33.05,28.62 v33.1,28.67
  other vias: 29.59,50.43 33.22,48.19 38.27,48.33 42.15,51.52 37.67,51.32 35.37,51.17 32.84,50.94 32.21,57.73 38.17,57.83 33,63.36 39.83,61.7 46.7,61.78 64.12,61.14 66.91,54.55 62.12,48.2 66.34,43.98 59.35,26.49 57.97,29.16 64.06,24.52 67.89,18.07 67.76,9.3 20.2,25.94 15.25,38.14 15.47,35.96 21.65,36.65 23.17,36.79 15.57,44.09 12.63,43.42 12.11,51.48 21.67,50.55 20.29,55.41 15.5,55.97 11.61,54.79 12.66,61.7 15.38,61.58 20.05,62.7 6.29,61.58 38.59,27.17 38.61,23.64 36.08,22.71 33.03,23.34 44.15,24.85 41.12,26.26 57.26,22.51 61.38,21.95 66.98,21.93 50.72,38.28 48.72,37.35 44.92,32.47 42.98,36.46 42.18,33.07 38.26,42.1 36.8,42.3 33.65,39.92 35.98,39.78 40.38,38.14 38.42,40.75 29.77,39.44 44.47,29.51 49.66,3.52 41.03,6.31 32.79,3.6 27.15,7.53 20.99,3.9 14.62,7.48 3,8.66 6.52,13.13 2.18,19.65 4.8,23.25 6.13,17.94 2.95,14.64 6.13,9.79 9.35,4.08 10.86,7.85 16.44,1.16 19.23,7.3 23.01,0.95 22.46,7.05 27.7,3.7 31.65,7.13 39.5,3.22 44.78,3.99 53.97,5.41 58.14,8.46 45.82,8.21 58.6,67.94 48.64,68.37 41.9,68.19 13.08,68.37 1.64,60.77 11.61,56.36 31.87,31.23 40.58,19.09 25.46,23.15 24.44,59.33 47.23,47.17 47.35,51.22 52.15,44.15 11.18,24.16 11.97,28.51 8.57,31.8 11.76,37.73 7.57,39.05 7.26,52.98 7.05,50.38 19.19,48.2 19.35,50.68 20.4,59.41
  pour Bottom: -11.47,77.33 85.33,77.33 -11.47,-10.07
  pour Top: 69.78,-0.17 0.18,0.08 -0.32,69.78 69.83,70.23
  pour Bottom: -3.52,-3.02 87.03,-3.02 87.03,76.34 -8.36,76.34 -9.63,-3.42 -4.76,-3.42
ENC0_CSN  (via drill 0.33)
  Top 0.152: U$8.P$7 47.97,23.31 48.05,23.4 v48.05,25.14
  Bottom 0.152: v48.05,25.14 48.1,24.96 48.1,26.33 | 48.1,26.33 48.11,26.33 | U3.P$52 48.1,26.33
ENC1_CSN  (via drill 0.33)
  Top 0.152: U$6.P$7 47.61,45.07 47.61,34.09 46.86,33.34 46.86,25 v46.71,24.85
  Bottom 0.152: v46.71,24.85 47.05,25.2 47.05,26.35 47.08,26.37 U3.P$54
ENC2_CSN  (via drill 0.33)
  Top 0.152: U$1.P$7 20.94,56.5 20.94,45.51 20.63,45.2 20.63,34.22 20.32,33.91 20.32,28.25 21.05,27.52 v22.57,27.52
  Bottom 0.152: v22.57,27.52 23.51,27.52 24.12,26.91 24.12,25.89 24.51,25.5 26.4,25.5 26.74,25.16 30.52,25.16 31,24.68 35.3,24.68 36.72,26.09 36.72,29.36 37.76,30.4 39.12,30.4 39.14,30.38 U3.P$3
ENC3_CSN  (via drill 0.33)
  Top 0.152: U$2.P$7 20.94,45.07 20.94,34.09 20.63,33.78 20.63,28.39 21.1,27.92 22.01,27.92 22.24,28.15 23.22,28.15 v23.25,28.18
  Bottom 0.152: v23.25,28.18 23.41,28.34 | 23.41,28.34 23.41,28.39 | 23.41,28.34 24.55,29.48 24.55,30.11 26.71,32.27 38.2,32.27 38.81,32.88 U3.P$8
ENC4_CSN  (via drill 0.33)
  Top 0.152: U$3.P$7 20.94,33.64 20.94,28.58 21.16,28.36 21.73,28.36 21.9,28.53 22.32,28.53 v22.78,28.99 | v37.58,32.96 37.58,29.44 38.27,28.75 v38.32,28.75
  Bottom 0.152: v22.78,28.99 22.87,29.08 23.08,29.08 26.58,32.58 37.2,32.58 v37.58,32.96 | v38.32,28.75 38.3,28.87 38.82,29.38 39.05,29.38 U3.P$1
ENC5_CSN  (via drill 0.33)
  Top 0.152: U$4.P$7 21.67,24.83 | 21.67,24.83 21.67,24.84 | 21.67,24.84 v23.37,26.54 21.67,24.84 | 21.67,24.83 v23.37,26.53
  Bottom 0.152: v23.37,26.54 23.37,26.6 23.43,26.66 23.8,26.29 23.8,25.77 24.38,25.19 26.27,25.19 26.61,24.85 30.39,24.85 30.87,24.37 35.44,24.37 37.03,25.96 37.03,28.86 38.05,29.88 39.05,29.88 U3.P$2
ENC6_CSN  (via drill 0.33)
  Top 0.152: U$7.P$7 47.17,33.2 47.17,25.26 47.42,25.01 47.42,24.66 46.82,24.06 v46.82,23.56
  Bottom 0.152: v46.82,23.56 47.38,24.12 47.38,25.76 47.59,25.97 47.59,26.33 47.58,26.33 U3.P$53
ENC7_CSN  (via drill 0.33)
  Top 0.152: U$5.P$7 46.55,55.44 46.55,45.98 47.3,45.23 47.3,34.22 46.55,33.47 46.55,28.65 46.26,28.36 v46.26,25.67
  Bottom 0.152: v46.26,25.67 46.58,25.99 U3.P$55
ENC_3_3V  (via drill 0.33)
  Top 0.152: v12.18,44.43 12.18,44.48 | v4.28,47.28 6.51,47.28 v7,46.79 | v9.04,56.26 6.13,59.16 2.92,59.16 | v1.67,50.58 1.67,57.91 2.92,59.16 | 2.92,59.16 6.92,63.16 v8.69,63.16 | v28.08,64.83 28.1,64.84 U$1.P$14
  Top 0.305: 55.96,62.85 55.98,62.87 55.98,65.69 55.84,65.83 55.84,66.92 55.44,67.31 v40.42,67.31 | v31.88,65.25 31.08,64.45 31.08,61.89 | v30.52,33.71 30.98,33.71 31.08,33.61
  Top 0.406: U$5.P$14 55.96,62.85 57.38,61.43 57.38,53.48 | 57.38,53.48 57.38,42.03 | 57.38,42.03 57.38,31.73 56.21,30.56 U$8.P$14 | U$7.P$14 57.34,41.98 57.38,42.03 | U$6.P$14 57.32,53.42 57.38,53.48 | U$4.P$14 31.08,32.35 31.08,33.61 31.08,41.78 | 31.08,41.78 31.08,53.62 | 31.08,53.62 31.08,61.89 31.08,62.78 29.29,64.56 U$1.P$14 | U$2.P$14 29.5,53.62 31.08,53.62 | U$3.P$14 29.5,41.78 31.08,41.78 | 33.21,25.77 33.21,26.29 34.05,27.14 34.05,32.72 v33.08,33.7
  Top 0.5: v37.71,13.45 36.58,13.45 34.98,15.05 | 34.98,15.05 34.98,17.11 32.91,19.18 32.91,20.97 34.05,22.11 34.05,24.93 33.21,25.77 | 33.21,33.57 v33.08,33.7 | J1.12 12.88,10.7 15.13,8.46 34.3,8.46 35.07,9.23 34.98,9.32 34.98,15.05
  Top 0.813: J1.1 J1.2
  Bottom 0.152: v12.18,44.43 13.08,45.33 R21.2 13.09,45.42 12.28,45.42 12.19,45.51 12.19,45.93 11.85,46.27 11.32,46.27 10.73,46.86 10.73,47.19 10.24,47.68 7.59,47.68 7,47.09 v7,46.79 | R7.2 11.82,35.73 10.25,35.73 9.43,36.55 7.52,36.55 7.05,36.09 2.57,36.09 2.33,36.33 2.33,46.73 2.87,47.28 | 2.87,47.28 v4.28,47.28 | R13.2 13.46,56.26 12.65,56.26 11.87,55.48 10.36,55.48 9.58,56.26 v9.04,56.26 | v1.67,50.58 1.67,48.48 2.87,47.28 | v8.69,63.16 8.95,62.9 12.67,62.9 14.6,64.83 v28.08,64.83
  Bottom 0.305: v40.42,67.31 38.35,65.25 v31.88,65.25
  Bottom 0.406: J1.12 9.9,10.7 8.65,11.96 8.65,16.26 11.33,18.94 JP2.2
  Bottom 0.5: J1.13 55.37,13.5 44.48,13.5 43.73,14.24 38.47,14.24 37.71,13.48 v37.71,13.45 | v33.08,33.7 v30.53,33.7 v30.52,33.71
  Bottom 0.813: J1.13 J1.1
ENC_MISO  (via drill 0.33)
  Top 0.152: 55.03,45.48 55.03,56.3 U$5.P$13 55.96,59.71 v55.98,59.73 | 55.03,45.48 55.03,34.38 | 55.03,34.38 55.03,26.03 55.93,25.13 55.93,22.98 55.98,22.98 55.98,22.96 U$8.P$13 | U$7.P$13 55.03,34.38 | U$6.P$13 55.64,45.48 55.03,45.48 | 28.13,34.18 28.13,45.93 29.16,45.93 U$2.P$13 29.3,47.96 28.66,48.6 28.66,51.25 28.13,51.78 28.13,56.07 U$1.P$13 v29.29,60.87 v29.28,60.88 | 28.13,34.18 v28.13,30.95 28.13,23.83 | 28.13,23.83 29.02,22.94 U$4.P$13 29.19,22.84 29.19,21.78 28.91,21.5 28.34,21.5 27.93,21.09 26.17,21.09 24.86,19.78 JP2.7 | U$3.P$13 29.1,34.18 28.13,34.18 | 29.04,22.91 28.51,23.44 28.15,23.8 28.13,23.82 28.13,23.83
  Bottom 0.152: U3.P$5 37.78,31.38 37.33,30.93 37.3,30.95 37.15,30.79 32.54,30.79 32.17,30.42 29.15,30.42 28.62,30.95 v28.13,30.95 | v55.98,59.73 54.28,59.73 53.23,60.78 50.62,60.78 50.23,60.38 29.78,60.38 v29.28,60.88
ENC_MOSI  (via drill 0.33)
  Top 0.152: U$8.P$11 54.62,24.15 54.62,34.28 | 54.62,34.28 54.62,45.73 | 54.62,45.73 54.62,56.02 U$5.P$11 53.42,59.69 v53.38,59.73 | U$6.P$11 54.55,45.8 54.62,45.73 | U$7.P$11 54.54,34.37 54.62,34.28 | 25.78,46.12 25.78,56.26 U$1.P$11 26.75,60.51 v26.73,60.53 | 25.78,46.12 25.78,34.28 25.79,34.28 | U$3.P$11 26.66,34.28 25.79,34.28 | U$2.P$11 26.42,46.12 25.78,46.12 | 26.69,21.47 26.69,21.81 | 26.69,21.81 26.69,22.29 26.75,22.35 U$4.P$11 26.75,23.51 25.78,24.48 25.78,27.9 v26.01,28.13 25.78,28.36 25.78,34.27 25.79,34.28 | JP2.6 21.49,20.5 21.86,20.87 22.66,20.87 22.97,21.18 24.82,21.18 25.45,21.81 26.69,21.81
  Bottom 0.152: v53.38,59.73 51.73,59.73 51.03,60.43 50.73,60.43 50.33,60.03 27.18,60.03 26.73,60.48 v26.73,60.53 | U3.P$6 39.04,31.88 38.97,31.96 26.85,31.96 26.01,31.12 v26.01,28.13
ENC_SCK  (via drill 0.33)
  Top 0.152: 24.18,57.23 U$1.P$9 | U$2.P$9 23.88,46.12 24.92,46.12 24.94,46.15 | 24.15,34.43 U$3.P$9 24.76,34.37 24.94,34.19 | 24.18,57.26 U$1.P$9 | U$5.P$9 v50.88,59.68 | 24.94,34.19 24.94,26.31 v24.77,26.14 24.21,25.58 U$4.P$9 23.91,22.64 23.91,21.82 23.86,21.77 23.02,21.77 22.43,21.18 20.35,21.18 JP2.5 | 24.94,34.19 24.94,46.15 | 24.94,46.15 24.94,56.5 U$1.P$9 | U$8.P$9 50.88,26.92 51.19,27.23 52.42,27.23 52.78,27.59 52.78,28.09 52.35,28.52 51.94,28.52 51.61,28.85 51.61,32.19 50.88,32.92 U$7.P$9 49.73,35.51 49.73,45.25 50.29,45.8 U$6.P$9 | U$1.P$9 24.21,58.18 v25.7,59.67
  Top 0.203: U$5.P$9 52.28,55.83 52.28,45.73 52.21,45.8 U$6.P$9
  Bottom 0.152: U3.P$4 37.73,30.88 37.33,30.48 32.67,30.48 32.3,30.11 28.43,30.11 28.24,29.92 27.86,29.92 26.87,28.93 26.87,27.16 25.84,26.13 v24.78,26.13 v24.77,26.14 | v50.88,59.68 v25.7,59.67
G
  Top 0.152: R26.R3A 65.73,29.56 U1.GRN
GND  (via drill 0.33)
  Top 0.152: U$2.P$2 13.32,53.42 v12.78,52.88 | U$3.P$2 14.1,42.04 14.17,42.04 | v12.48,41.88 12.06,41.88 11.95,41.98
  Top 0.254: v12.78,52.88 v12.78,54.12 v12.78,55.38
  Top 0.406: v12.48,41.88 12.48,41.93 | 44.48,36.03 44.14,35.68 44.14,31.03 43.12,30.02 43.12,30.43 U$8.P$4
  Top 0.61: U$2.P$4 U$2.P$2 | U$3.P$4 16.57,41.98 U$3.P$2 | U$4.P$4 U$4.P$2
  Top 0.813: U$8.P$2 U$8.P$4 | U$1.P$4 16.64,64.89 16.64,67.03 17.8,68.19 36.5,68.19 39.84,64.84 U$5.P$2 | U$5.P$4 44.48,63.62 44.48,53.6 | 44.48,53.6 44.48,41.86 | 44.48,41.86 44.48,36.03 | U$7.P$4 43.39,41.86 44.48,41.86 | U$6.P$4 43.44,53.6 44.48,53.6 | B1.2 10.43,25.37 10.43,32.55
  Top 1: U$2.P$2 10.44,53.42 10.43,53.43 | U$5.P$2 U$5.P$4 | U$6.P$2 U$6.P$4 | U$7.P$4 U$7.P$2 | U$3.P$4
  Top 1.27: 10.43,42.18 10.43,53.43 10.43,63.12 12.15,64.84 U$1.P$2 U$1.P$4 | 10.43,42.18 10.43,32.55 10.43,32.28 12.18,30.53 v12.45,30.53 12.95,30.53 13.73,30.53 13.76,30.56 U$4.P$2 | U$3.P$2 11.95,41.98 10.62,41.98 10.43,42.18
  Bottom 0.152: Q17.3 12.86,41.49 v12.48,41.88 | Q9.1 12.8,30.88 v12.45,30.53
  Bottom 0.254: Q13.3 14.13,52.88 v12.78,52.88 | Q13.2 14.15,54.12 v12.78,54.12 | Q13.1 v12.78,55.38 | Q9.3 Q9.2 Q9.1
  Bottom 0.406: Q17.1 Q17.2 Q17.3 14.15,41.48
GREEN  (via drill 0.33)
  Top 0.152: R26.R3B 62.32,29.56 62.23,29.48 62.23,28 62.46,27.78 62.46,25.03 60.19,22.76 60.19,19.21 59.18,18.2 49.98,18.2 49.82,18.36 49.82,21.12 49.38,21.56 49.38,29.68 v49.69,29.99
  Bottom 0.152: 49.77,29.99 v49.69,29.99 50.58,30.88 U3.P$45
HEAT1
  Bottom 0.152: IC2.4 9.48,33.83 9.78,33.53 10.78,33.53 | 10.78,33.53 IC2.1 | 10.78,33.53 11.33,33.53 11.68,33.18 11.68,32.73 11.83,32.58 14.58,32.58 14.78,32.78 14.78,34.12 15.53,34.88 27.63,34.88 28.42,35.67 37.37,35.67 38.15,34.88 U3.P$12
HEAT1_ON
  Bottom 0.152: R12.2 C19.2 27.63,33.43 29.56,35.36 37.23,35.36 38.21,34.38 U3.P$11
HEAT2
  Bottom 0.152: 11.29,57.98 IC3.4 | 11.29,57.98 11.69,57.98 12.13,58.43 17.28,58.43 18.13,57.58 20.98,57.58 22.08,56.48 23.18,56.48 24.98,54.68 24.98,41.43 25.73,40.68 25.73,39.23 27.33,37.62 36.73,37.62 37.98,36.38 U3.P$15 | 11.29,57.98 IC3.1
HEAT2_ON
  Bottom 0.152: U3.P$16 37.92,36.88 36.33,38.48 29.13,38.48 25.78,41.83 25.78,57.28 24.23,57.28 20.18,61.33 C22.2 16.98,61.33 R18.2
HEAT3
  Bottom 0.152: IC4.1 11.38,45.23 | IC4.4 11.38,45.73 IC4.1 | IC4.1 11.38,44.28 11.73,43.93 11.73,41.33 12.13,40.93 16.58,40.93 17.63,41.98 17.63,42.28 17.93,42.58 19.33,42.58 19.78,42.12 19.78,41.18 19.48,40.88 17.88,40.88 17.73,40.73 17.73,39.83 18.53,39.03 22.93,39.03 25.98,35.98 37.5,35.98 38.09,35.38 U3.P$13
HEAT3_ON
  Bottom 0.152: U3.P$14 38.03,35.88 37.23,36.68 26.68,36.68 24.93,38.43 24.93,40.03 24.18,40.78 24.18,47.88 23.58,48.48 C27.2 R25.2
MCLRN  (via drill 0.33)
  Top 0.152: X1.1 60.25,13.95 48.93,13.95 47.52,15.36 47.52,17.17 47.05,17.64 47.05,20.4 46.3,21.14 40.16,21.14 39.98,21.31 39.98,25.59 v39.18,26.4 | v42.03,29.53 42.03,28.63 41.52,28.12 41.52,27.75 v40.95,27.18
  Bottom 0.152: U3.P$7 41.54,32.38 42.03,31.89 v42.03,29.53 | R5.2 64.57,9.63 X1.1 | v40.95,27.18 40.17,26.4 v39.18,26.4
N$1
  Bottom 0.152: U3.P$62 43.08,26.23 39.17,22.32 37.66,22.32 36.68,21.34 32.48,21.34 31.65,20.5 JP2.10
N$2
  Bottom 0.254: U18.3 30.58,29.58 R4.2
N$3
  Bottom 0.254: C9.1 34.62,29.88 U18.4
N$4
  Bottom 0.203: C3.1 56.93,25.08 X2.P$3 55.88,24.98 54.88,24.98 54.12,25.73 54.12,29.53 56.18,31.58 56.18,32.78 55.98,32.98 53.28,32.98 52.87,33.38 U3.P$40
N$5
  Bottom 0.152: 51.18,26.43 51.15,26.4 C10.+
  Bottom 0.254: C11.1 51.53,26.08 51.18,26.43 50.93,26.43 50.98,26.38 | U3.P$56 46.08,28.33 46.68,28.93 49.43,28.93 51.08,27.28 C10.+
N$6
  Bottom 0.203: U3.P$39 56.27,33.88 57.08,33.08 57.08,30.63 C2.1 57.12,29.33 X2.P$1
N$7
  Bottom 0.152: J16.3 5.92,31.83 7.43,31.83 8.08,32.48 IC2.3 9.48,31.88 9.83,31.53 14.78,31.53 15.13,31.88 15.13,33.68 15.58,34.12 R8.2
N$9
  Bottom 0.152: C13.1 R7.1 10.88,34.28 IC2.5 9.93,35.23 6.78,35.23 J16.4
N$11
  Bottom 0.152: Q7.1 15.93,26.97 | 15.58,26.83 Q7.1 | Q7.1 15.88,26.88 | Q7.1 15.83,26.87 Q7.1 | Q7.1 15.26,27.41 | 15.26,27.41 14.92,27.78 13.08,27.78 12.73,27.43 12.73,26.58 13.23,26.08 13.98,26.08 14.63,25.43 | 14.63,25.43 14.63,23.88 R11.1 | Q8.3 18.68,26.13 17.98,25.43 14.63,25.43 | Q6.1 15.13,30.23 15.13,27.55 15.26,27.41
N$12
  Bottom 0.152: C19.1 R12.1 20.18,30.83 20.97,30.03 Q8.1
N$15
  Bottom 0.152: Q7.2 17.63,26.87 | 17.68,30.68 Q6.2 16.73,29.93 15.88,29.93 15.48,29.53 15.48,28.03 15.78,27.73 16.38,27.73 16.48,27.63 17.13,27.63 17.63,27.13 17.63,26.87 | Q9.4 14.12,26.58 14.93,25.78 16.53,25.78 17.63,26.87
N$17
  Bottom 0.152: IC3.3 R14.2 8.28,56.43 7.68,55.83 7.68,55.38 6.48,54.18 J2.3
N$19
  Bottom 0.152: C20.1 12.77,59.29 IC3.5 10.75,59.83 9.43,59.83 9.23,59.62 9.23,58.48 8.88,58.12 6.44,58.12 J2.4 | C20.1 12.88,59.18 | R13.1 C20.1
N$20
  Bottom 0.152: 20.28,51.98 20.28,53.93 19.23,54.98 Q10.1 17.88,54.98 16.83,56.03 16.83,57.08 Q12.3 | 20.28,51.98 19.93,51.63 Q11.1 | 20.28,51.98 20.28,49.62 19.73,49.08 17.93,49.08 17.68,49.33 16.43,49.33 | 16.43,49.33 16.38,49.28 | 16.43,49.33 R16.1
N$22
  Bottom 0.152: Q12.1 18.87,59.58 C22.1 18.68,59.48 16.78,59.48 16.88,59.58 R18.1
N$23
  Bottom 0.152: Q10.2 18.28,53.08 17.63,52.43 17.63,52.08 | Q13.4 15.32,51.57 15.88,52.12 17.58,52.12 17.63,52.08 | 17.63,52.08 17.63,50.98 Q11.2
N$24
  Bottom 0.152: J3.3 6.3,42.75 7.48,43.93 7.48,44.28 R22.2 IC4.3
N$26
  Bottom 0.152: J3.4 5.03,46.13 6.93,48.03 10.38,48.03 IC4.5 R21.1 14.53,47.03 C25.1
N$27
  Bottom 0.152: Q15.1 19.78,40.28 20.38,40.88 | 20.38,40.88 20.38,42.73 19.58,43.53 Q14.1 18.43,43.78 17.33,43.78 16.38,44.72 Q16.3 | R24.1 20.38,40.33 20.38,40.88
N$28
  Bottom 0.152: Q16.1 R25.1 C27.1
N$29
  Bottom 0.152: Q17.4 17.37,40.22 | 17.37,40.22 17.38,40.23 17.38,41.28 17.63,41.53 18.58,41.53 Q14.2 | Q15.2 17.37,39.67 17.37,40.22
N$32  (via drill 0.33)
  Top 0.152: J1.16 45.48,13.32 47.77,11.03 47.77,8.91 48.11,8.57 v48.27,8.57
  Bottom 0.152: Q1.3 48.23,4.35 49.66,4.35 | 49.66,4.35 R20.1 | v48.27,8.57 49.66,7.18 49.66,4.35
N$70
  Bottom 0.152: U3.P$59 44.58,25.71 44.37,25.5 43.89,25.5 43.5,25.11 43.28,25.11 39.34,21.17 39.34,20.85 39.27,20.78 JP2.13
N$71
  Bottom 0.152: U3.P$60 44.08,26.13 43.37,25.42 43.15,25.42 39.43,21.7 38.03,21.7 36.73,20.4 JP2.12
N$72
  Bottom 0.152: U3.P$61 43.58,26.07 43.23,25.73 43.02,25.73 39.3,22.01 37.9,22.01 36.92,21.03 34.39,21.03 34.19,20.83 JP2.11
N$74
  Bottom 0.152: U3.P$63 42.58,26.17 39.05,22.64 37.54,22.64 36.55,21.65 32.35,21.65 31.57,20.87 30.3,20.87 29.21,19.78 JP2.9
N$75
  Bottom 0.152: U3.P$64 42.08,26.11 38.92,22.95 37.41,22.95 36.42,21.96 32.21,21.96 31.43,21.18 30.17,21.18 29.89,20.9 28.25,20.9 27.13,19.78 JP2.8
PGC  (via drill 0.33)
  Top 0.152: v37.58,39.43 37.98,39.02 37.98,38.04 37.8,37.86 37.45,37.86 34.82,35.23 34.82,27.63 35.12,27.33 35.12,25.74 37.73,23.12 37.73,20.75 38.12,20.37 38.12,19.09 38.89,18.32 42.34,18.32 42.64,18.62 45.62,18.62 47.2,17.04 47.2,15.24 48.8,13.64 60.12,13.64 62.85,10.91 62.85,9.19 63.55,8.49 65.87,8.49 66.37,8.99 66.37,17.99 X1.5
  Bottom 0.152: U3.P$17 41.54,39.43 v37.58,39.43
PGD  (via drill 0.33)
  Top 0.152: v37.48,40.48 36.98,40.48 36.98,38.87 37.68,38.17 37.32,38.17 34.5,35.35 34.5,27.17 34.8,26.86 34.8,25.6 37.42,22.98 37.42,20.62 37.8,20.24 37.8,18.96 38.76,18.01 42.73,18.01 43.55,17.18 43.55,9.61 44.32,8.85 46.51,8.85 47.58,7.78 50.5,7.78 51.85,9.13 51.85,11.79 52.69,12.63 60.69,12.63 62.54,10.78 62.54,9.06 63.42,8.18 66,8.18 66.67,8.86 66.67,20.05 65.83,20.9 63.38,20.9 62.7,20.22 62.7,19.12 X1.4
  Bottom 0.152: U3.P$18 42.58,39.73 42.4,39.92 41.84,39.92 41.66,39.73 38.12,39.73 37.55,40.3 v37.48,40.48
PS_ON  (via drill 0.33)
  Top 0.152: v44.41,23.6 v44.44,21.77 | v46.9,14.52 46.9,13 v47.36,12.54
  Bottom 0.152: U3.P$58 45.1,25.54 44.8,25.24 44.8,23.82 44.58,23.6 v44.41,23.6 v44.4,23.6 | v44.44,21.77 44.45,18.05 43.77,17.4 43.77,15.33 44.9,14.2 46.58,14.2 v46.9,14.52 | v47.36,12.54 47.36,7.69 46.82,7.15 Q1.1
R
  Top 0.152: R26.R4A 66.73,28.66 U1.RED
RED  (via drill 0.33)
  Top 0.152: R26.R4B 62.77,24.9 60.5,22.63 60.5,19.08 59.3,17.89 49.85,17.89 49.51,18.23 49.51,20.99 49.07,21.43 49.07,30.46 v49.71,31.1
  Bottom 0.152: 49.85,31.1 v49.71,31.1 49.99,31.38 U3.P$44
SERVO0
  Bottom 0.152: U8.11 41.25,44.93 41.9,45.58 42.18,45.58 44.08,43.67 U3.P$21
SERVO0_5V  (via drill 0.33)
  Top 0.152: U$8.P$8 49.43,31.67 49.43,47.88 49.62,48.08 v49.68,48.08
  Bottom 0.152: v49.68,48.08 49.08,47.48 47.87,47.48 45.17,50.18 45.17,55.05 43.83,56.4 41.57,56.4 39.97,54.8 39.97,54.37 39.98,54.36 U8.9
SERVO1
  Bottom 0.152: U3.P$22 44.58,41.67 44.43,41.83 44.43,43.83 42.33,45.93 41.78,45.93 41.12,45.28 39.03,45.28 38.73,44.98 38.73,43.78 38.71,43.76 U8.13
SERVO1_5V  (via drill 0.33)
  Top 0.152: U$6.P$8 49.08,52.68 v49.08,50.33
  Bottom 0.152: v49.08,50.33 46.34,50.33 46.1,50.57 46.1,55.45 44.21,57.34 41.18,57.34 39.4,55.55 35.23,55.55 34.94,55.27 33.01,55.27 32.4,54.66 32.4,54.37 32.36,54.33 U8.3
SERVO2
  Bottom 0.152: U3.P$23 45.08,41.67 44.78,41.98 44.78,43.93 42.43,46.28 41.62,46.28 41.12,45.78 36.48,45.78 36.18,45.48 U8.15 | U8.15 | U8.15
SERVO2_5V  (via drill 0.33)
  Top 0.152: U$1.P$8 21.67,62.89 22.78,61.78 27.23,61.78 28.08,60.93 28.08,58.78 v27.98,58.68
  Bottom 0.152: v27.98,58.68 27.98,58.23 27.02,57.27 27.02,42.35 27.96,41.41 31.64,41.41 32.35,42.12 32.35,42.48 32.36,42.5 U8.18
SERVO3
  Bottom 0.152: U3.P$24 45.58,41.67 45.12,42.12 45.12,44.03 42.53,46.62 41.53,46.62 41.03,46.12 34.33,46.12 33.62,45.43 U8.17
SERVO3_5V  (via drill 0.33)
  Top 0.152: U$2.P$8 22.43,54.18 22.43,59.73 21.28,60.88 v21.28,61.38
  Bottom 0.152: v21.28,61.38 21.28,60.67 24.36,57.59 25.91,57.59 26.09,57.41 26.09,41.96 27.57,40.48 32.03,40.48 32.91,41.36 39.27,41.36 40,42.09 40,43.72 U8.12
SERVO4
  Bottom 0.152: U3.P$27 47.08,40.78 47.58,41.28 47.58,44.48 42.33,49.73 32.58,49.73 31.09,51.22 U8.2
SERVO4_5V  (via drill 0.33)
  Top 0.152: U$3.P$8 21.67,43.42 22.41,44.16 22.41,53.72 22.78,54.08 22.78,60.78 v22.23,61.33
  Bottom 0.152: v22.23,61.33 22.23,60.68 23.23,59.68 23.23,59.16 24.49,57.9 26.04,57.9 26.4,57.54 26.4,42.09 27.7,40.79 31.9,40.79 32.78,41.67 37.04,41.67 37.46,42.09 37.46,43.72 U8.14
SERVO5
  Bottom 0.152: U3.P$28 47.58,40.78 47.93,41.12 47.93,44.58 42.43,50.08 35.28,50.08 33.62,51.73 U8.4
SERVO5_5V  (via drill 0.33)
  Top 0.152: U$4.P$8 22.4,31.29 22.4,43.71 22.72,44.03 22.72,53.57 23.09,53.94 23.09,60.52 v23.44,60.87
  Bottom 0.152: v23.44,60.87 23.54,60.77 23.54,59.29 24.62,58.21 26.17,58.21 26.71,57.67 26.71,42.22 27.83,41.1 31.77,41.1 32.66,41.98 34.5,41.98 34.92,42.41 34.92,43.72 U8.16
SERVO6
  Bottom 0.152: U3.P$29 48.08,39.83 48.28,40.03 48.28,44.68 42.53,50.43 37.18,50.43 36.17,51.44 U8.6
SERVO6_5V  (via drill 0.33)
  Top 0.152: U$7.P$8 49.08,42.73 49.08,47.48 48.58,47.98 v48.58,48.28
  Bottom 0.152: v48.58,48.28 47.51,48.28 45.48,50.3 45.48,55.19 43.95,56.72 41.44,56.72 39.66,54.94 37.98,54.94 37.44,54.4 U8.7
SERVO7
  Bottom 0.152: U3.P$30 48.58,44.87 42.68,50.78 39.62,50.78 38.71,51.7 U8.8
SERVO7_5V  (via drill 0.33)
  Top 0.152: U$5.P$8 49.43,63.76 49.43,51.03 49.68,50.78 v49.68,49.08
  Bottom 0.152: v49.68,49.08 47.15,49.08 45.79,50.44 45.79,55.32 44.08,57.03 41.3,57.03 39.53,55.25 35.36,55.25 34.94,54.83 34.94,54.37 34.9,54.33 U8.5
U1RX
  Bottom 0.152: R19.R2A 59.39,18.94 59.18,18.73 57.12,18.73 J10.RX 54.88,18.6 47.54,18.6 46.97,19.17 46.97,20.41 47.73,21.18 47.73,22.61 49.08,23.95 U3.P$50
U1TX
  Bottom 0.152: R19.R3A 59.02,18.14 58.88,18.28 47.42,18.28 J10.TX 47.43,21.31 47.43,22.74 48.78,24.09 48.78,25.55 48.58,25.74 U3.P$51
USBID
  Bottom 0.152: U25.4 62.2,34.2 62.68,34.68 62.68,36.48 62.48,36.68 62.48,36.98 62.18,37.28 59.38,37.28 59.08,36.98 56.12,36.98 55.48,37.62 53.53,37.62 | U3.P$33 52.78,36.88 53.53,37.62 | 54.68,37.38 R6.2 53.58,37.68 53.53,37.62
VBUS
  Bottom 0.152: 60.89,36.58 arc90 U25.1 55.4,36.6 55.18,36.83 53.33,36.83 52.88,36.38 U3.P$34 50.58,36.39 50.52,36.45 50.52,37.1 50.69,37.27 52.22,37.27 52.87,37.92 D1.A